# Altium project Filter_PCB_Project.PrjPcb
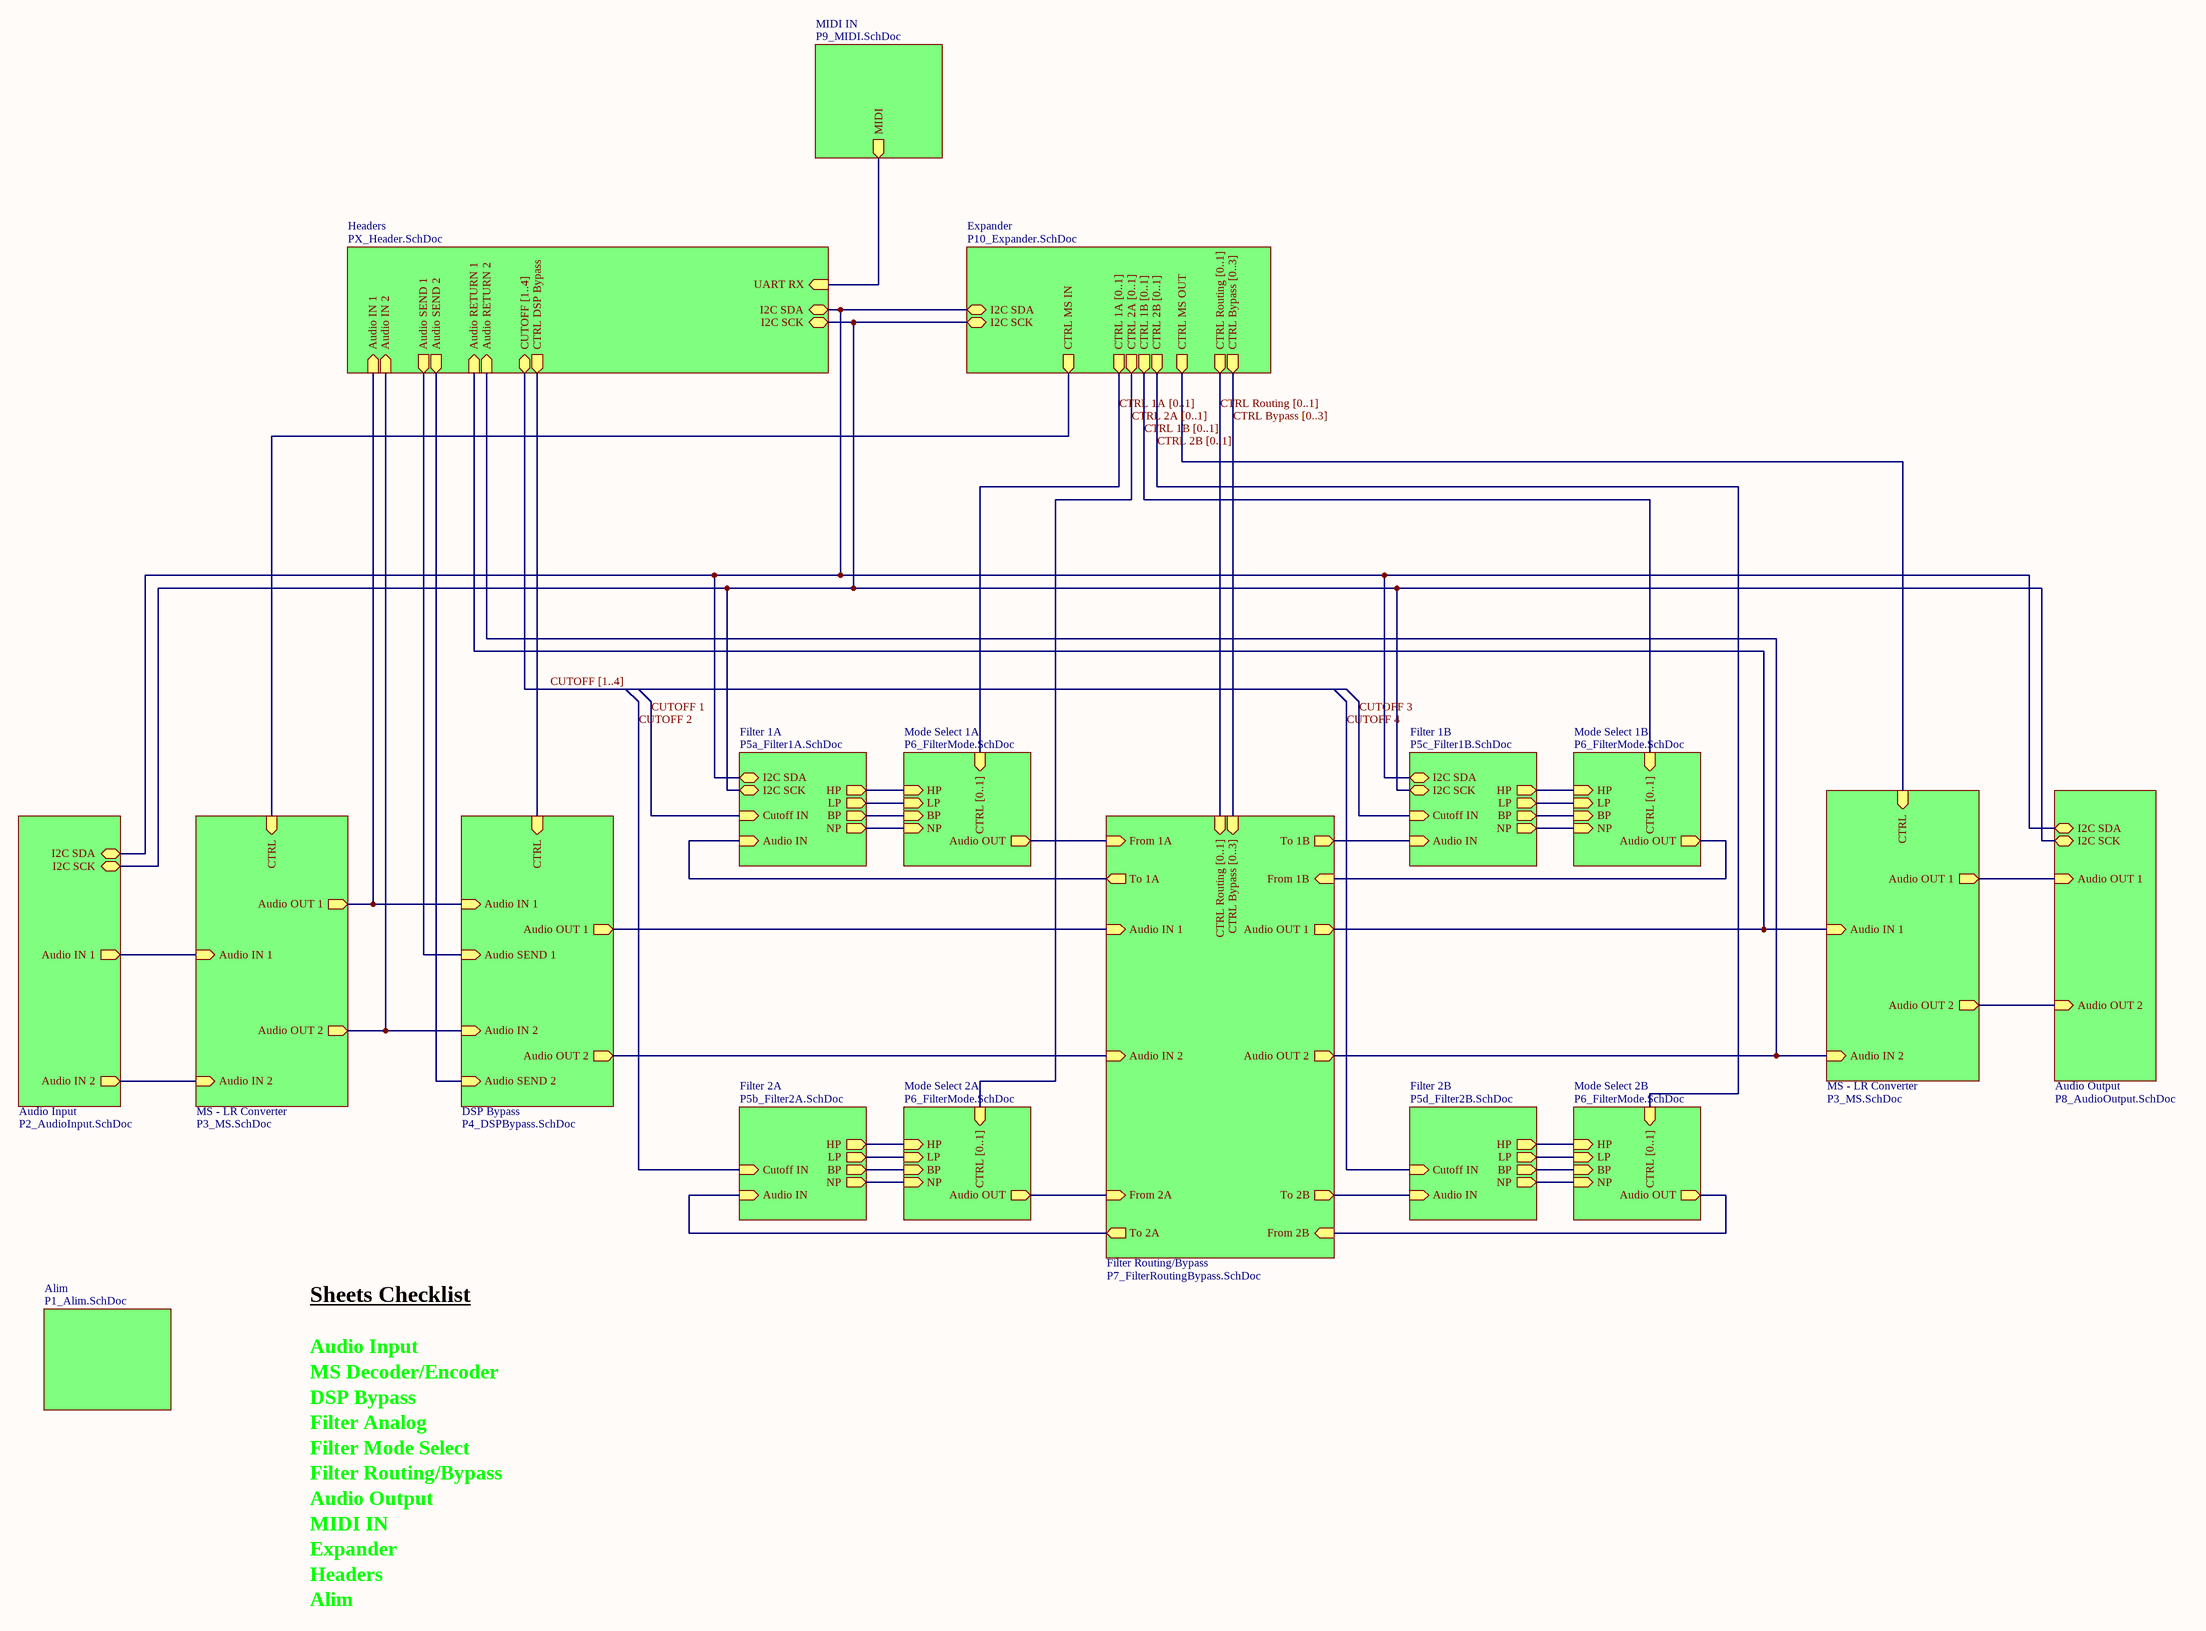
[diagram p0: P0_MASTER.SchDoc]
11 sheets, 315 parts. Net scope: hierarchical (ports join the sheet entries above them; power ports are global).
Sheets:
  P0_MASTER.SchDoc
    Audio Input = P2_AudioInput.SchDoc
    Alim = P1_Alim.SchDoc
    MS - LR Converter = P3_MS.SchDoc
    Mode Select 1A = P6_FilterMode.SchDoc
    Filter 2A = P5b_Filter2A.SchDoc
    Mode Select 2A = P6_FilterMode.SchDoc
    Filter Routing/Bypass = P7_FilterRoutingBypass.SchDoc
    Filter 1B = P5c_Filter1B.SchDoc
    Mode Select 1B = P6_FilterMode.SchDoc
    Mode Select 2B = P6_FilterMode.SchDoc
    MS - LR Converter = P3_MS.SchDoc
    Audio Output = P8_AudioOutput.SchDoc
    Expander = P10_Expander.SchDoc
    MIDI IN = P9_MIDI.SchDoc

## Sheet P0_MASTER.SchDoc
size C

### Sub-sheets
Alim = P1_Alim.SchDoc: no entries
Audio Input = P2_AudioInput.SchDoc: Audio IN 1 (out), I2C SCK, I2C SDA, Audio IN 2 (out)
Audio Output = P8_AudioOutput.SchDoc: Audio OUT 1 (in), I2C SCK, I2C SDA, Audio OUT 2 (in)
DSP Bypass = P4_DSPBypass.SchDoc (file not in this document): Audio SEND 1 (in), Audio SEND 2 (in), Audio IN 1 (in), Audio IN 2 (in), Audio OUT 1 (out), Audio OUT 2 (out), CTRL (in)
Expander = P10_Expander.SchDoc: I2C SCK, I2C SDA, CTRL MS IN (out), CTRL 1A [0..1] (out), CTRL 2A [0..1] (out), CTRL 1B [0..1] (out), CTRL 2B [0..1] (out), CTRL MS OUT (out), CTRL Routing [0..1] (out), CTRL Bypass [0..3] (out)
Filter 1A = P5a_Filter1A.SchDoc (file not in this document): HP (out), LP (out), BP (out), NP (out), Audio IN (in), I2C SCK, I2C SDA, Cutoff IN (in)
Filter 1B = P5c_Filter1B.SchDoc: HP (out), LP (out), BP (out), NP (out), Audio IN (in), I2C SCK, I2C SDA, Cutoff IN (in)
Filter 2A = P5b_Filter2A.SchDoc: HP (out), LP (out), BP (out), NP (out), Audio IN (in), Cutoff IN (in)
Filter 2B = P5d_Filter2B.SchDoc (file not in this document): HP (out), LP (out), BP (out), NP (out), Audio IN (in), Cutoff IN (in)
Filter Routing/Bypass = P7_FilterRoutingBypass.SchDoc: From 1A (in), From 2A (in), To 2A (out), To 1A (out), Audio IN 1 (in), Audio IN 2 (in), Audio OUT 1 (out), Audio OUT 2 (out), To 1B (out), From 1B (in), To 2B (out), From 2B (in), CTRL Routing [0..1] (in), CTRL Bypass [0..3] (in)
Headers = PX_Header.SchDoc (file not in this document): Audio IN 1 (in), Audio IN 2 (in), Audio SEND 1 (out), Audio SEND 2 (out), Audio RETURN 1 (in), Audio RETURN 2 (in), I2C SCK, I2C SDA, CUTOFF [1..4], UART RX (in), CTRL DSP Bypass (out)
MIDI IN = P9_MIDI.SchDoc: MIDI (out)
Mode Select 1A = P6_FilterMode.SchDoc: HP (in), LP (in), BP (in), NP (in), Audio OUT (out), CTRL [0..1] (in)
Mode Select 1B = P6_FilterMode.SchDoc: HP (in), LP (in), BP (in), NP (in), Audio OUT (out), CTRL [0..1] (in)
Mode Select 2A = P6_FilterMode.SchDoc: HP (in), LP (in), BP (in), NP (in), Audio OUT (out), CTRL [0..1] (in)
Mode Select 2B = P6_FilterMode.SchDoc: HP (in), LP (in), BP (in), NP (in), Audio OUT (out), CTRL [0..1] (in)
MS - LR Converter = P3_MS.SchDoc: Audio IN 1 (in), Audio IN 2 (in), Audio OUT 1 (out), Audio OUT 2 (out), CTRL (in)
MS - LR Converter = P3_MS.SchDoc: Audio IN 1 (in), Audio IN 2 (in), Audio OUT 1 (out), Audio OUT 2 (out), CTRL (in)

### Nets
CUTOFF 1: sheet Filter 1A/Cutoff IN
CUTOFF 4: sheet Filter 2B/Cutoff IN
From Audio IN 2: sheet DSP Bypass/Audio OUT 2, sheet Filter Routing/Bypass/Audio IN 2
To 1A: sheet DSP Bypass/Audio OUT 1, sheet Filter Routing/Bypass/Audio IN 1
NetC17_1: sheet Audio Input/Audio IN 1, sheet MS - LR Converter/Audio IN 1
NetC31_1: sheet Audio Input/Audio IN 2, sheet MS - LR Converter/Audio IN 2
NetC61_2: sheet Filter 2A/LP, sheet Mode Select 2A/LP
NetC62_2: sheet Filter 2A/BP, sheet Mode Select 2A/BP
NetC69_2: sheet Filter 1B/LP, sheet Mode Select 1B/LP
NetC70_2: sheet Filter 1B/BP, sheet Mode Select 1B/BP
NetC85_Mode_Select_1A_1: sheet Mode Select 1A/Audio OUT, sheet Filter Routing/Bypass/From 1A
NetC85_Mode_Select_1B_1: sheet Filter Routing/Bypass/From 1B, sheet Mode Select 1B/Audio OUT
NetC85_Mode_Select_2A_1: sheet Mode Select 2A/Audio OUT, sheet Filter Routing/Bypass/From 2A
NetC85_Mode_Select_2B_1: sheet Filter Routing/Bypass/From 2B, sheet Mode Select 2B/Audio OUT
NetC100_2: sheet MS - LR Converter/Audio OUT 1, sheet Audio Output/Audio OUT 1
NetC104_2: sheet MS - LR Converter/Audio OUT 2, sheet Audio Output/Audio OUT 2
NetR48_MS_-_LR_Converter#1_1: sheet MS - LR Converter/CTRL, sheet Expander/CTRL MS IN
NetR48_MS_-_LR_Converter#2_1: sheet MS - LR Converter/CTRL, sheet Expander/CTRL MS OUT
NetR81_2: sheet Filter 2A/NP, sheet Mode Select 2A/NP
NetR83_2: sheet Filter 2A/HP, sheet Mode Select 2A/HP
NetR92_2: sheet Filter 2A/Audio IN, sheet Filter Routing/Bypass/To 2A
NetR101_2: sheet Filter 1B/NP, sheet Mode Select 1B/NP
NetR103_2: sheet Filter 1B/HP, sheet Mode Select 1B/HP
NetR112_2: sheet Filter Routing/Bypass/To 1B, sheet Filter 1B/Audio IN
NetR172_1: sheet Headers/UART RX, sheet MIDI IN/MIDI
NetU2_2: sheet Audio Input/I2C SCK, sheet Headers/I2C SCK, sheet Filter 1A/I2C SCK, sheet Filter 1B/I2C SCK, sheet Audio Output/I2C SCK, sheet Expander/I2C SCK
NetU2_3: sheet Audio Input/I2C SDA, sheet Headers/I2C SDA, sheet Filter 1A/I2C SDA, sheet Filter 1B/I2C SDA, sheet Audio Output/I2C SDA, sheet Expander/I2C SDA
NetU4_MS_-_LR_Converter#1_9: sheet Headers/Audio IN 2, sheet DSP Bypass/Audio IN 2, sheet MS - LR Converter/Audio OUT 2
NetU4_MS_-_LR_Converter#1_12: sheet Headers/Audio IN 1, sheet DSP Bypass/Audio IN 1, sheet MS - LR Converter/Audio OUT 1
NetU4_MS_-_LR_Converter#2_4: sheet Headers/Audio RETURN 1, sheet Filter Routing/Bypass/Audio OUT 1, sheet MS - LR Converter/Audio IN 1
NetU4_MS_-_LR_Converter#2_7: sheet Headers/Audio RETURN 2, sheet Filter Routing/Bypass/Audio OUT 2, sheet MS - LR Converter/Audio IN 2
NetU20_Mode_Select_1A_11: sheet Filter 1A/NP, sheet Mode Select 1A/NP
NetU20_Mode_Select_1A_12: sheet Filter 1A/HP, sheet Mode Select 1A/HP
NetU20_Mode_Select_1A_14: sheet Filter 1A/LP, sheet Mode Select 1A/LP
NetU20_Mode_Select_1A_15: sheet Filter 1A/BP, sheet Mode Select 1A/BP
NetU20_Mode_Select_2B_11: sheet Filter 2B/NP, sheet Mode Select 2B/NP
NetU20_Mode_Select_2B_12: sheet Filter 2B/HP, sheet Mode Select 2B/HP
NetU20_Mode_Select_2B_14: sheet Filter 2B/LP, sheet Mode Select 2B/LP
NetU20_Mode_Select_2B_15: sheet Filter 2B/BP, sheet Mode Select 2B/BP
NetU21_3: sheet Filter 1A/Audio IN, sheet Filter Routing/Bypass/To 1A
NetU30_3: sheet Filter Routing/Bypass/To 2B, sheet Filter 2B/Audio IN
(unnamed): sheet Headers/Audio SEND 1, sheet DSP Bypass/Audio SEND 1
(unnamed): sheet Headers/Audio SEND 2, sheet DSP Bypass/Audio SEND 2
(unnamed): sheet Headers/CTRL DSP Bypass, sheet DSP Bypass/CTRL

### Buses and harness runs
bus CTRL 1A [0..1] = sheet Expander/CTRL 1A [0..1] = sheet Mode Select 1A/CTRL [0..1]
bus CTRL 1B [0..1] = sheet Expander/CTRL 1B [0..1] = sheet Mode Select 1B/CTRL [0..1]
bus CTRL 2A [0..1] = sheet Expander/CTRL 2A [0..1] = sheet Mode Select 2A/CTRL [0..1]
bus CTRL 2B [0..1] = sheet Expander/CTRL 2B [0..1] = sheet Mode Select 2B/CTRL [0..1]
bus CTRL Bypass [0..3] = sheet Expander/CTRL Bypass [0..3] = sheet Filter Routing/Bypass/CTRL Bypass [0..3]
bus CTRL Routing [0..1] = sheet Expander/CTRL Routing [0..1] = sheet Filter Routing/Bypass/CTRL Routing [0..1]
bus CUTOFF [1..4] = sheet Headers/CUTOFF [1..4]

### Notes on the sheet
- Sheets Checklist
- Audio Input
- MS Decoder/Encoder
- DSP Bypass
- Filter Analog
- Filter Mode Select
- Filter Routing/Bypass
- Audio Output
- MIDI IN
- Expander
- Headers
- Alim

## Sheet P2_AudioInput.SchDoc
size 254 x 241 mm
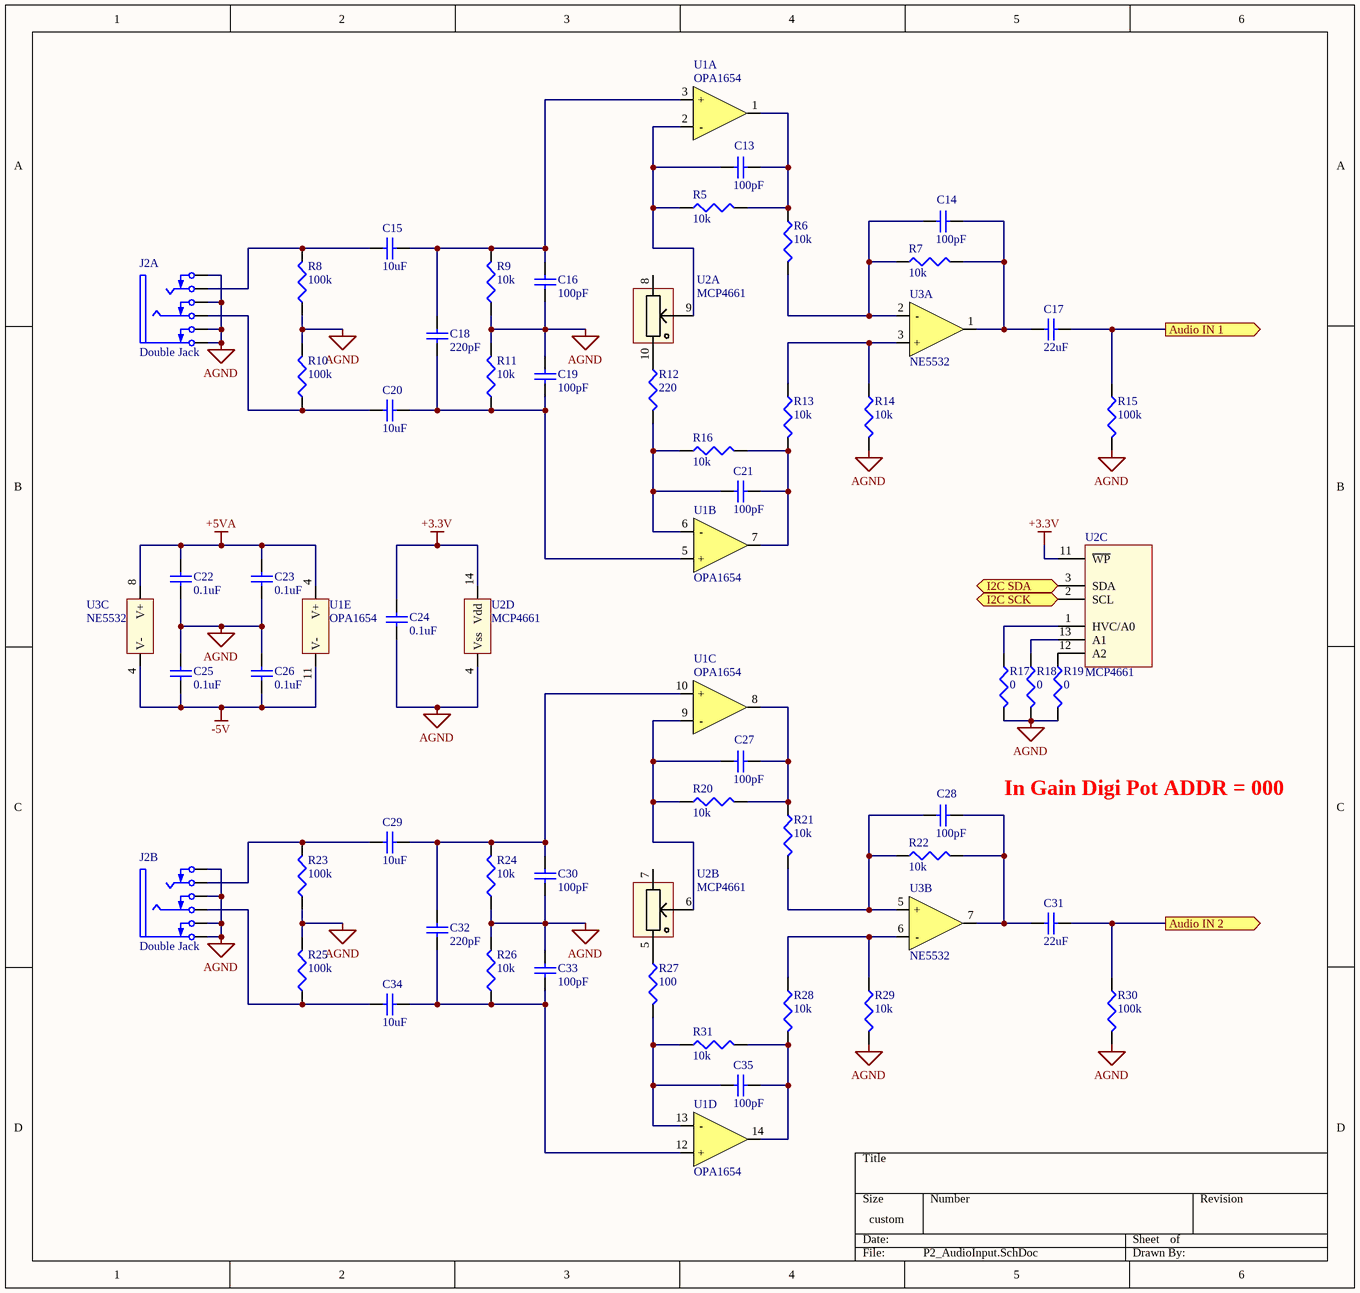
[diagram p1: P2_AudioInput.SchDoc]

### Parts
C13  100pF  [CAP 0603 (1608 metric)]
C14  100pF  [CAP 0603 (1608 metric)]
C15  10uF  [CAP 0603 (1608 metric)]
C16  100pF  [CAP 0603 (1608 metric)]
C17  22uF  [CAP 0603 (1608 metric)]
C18  220pF  [CAP 0603 (1608 metric)]
C19  100pF  [CAP 0603 (1608 metric)]
C20  10uF  [CAP 0603 (1608 metric)]
C21  100pF  [CAP 0603 (1608 metric)]
C22  0.1uF  [CAP 0603 (1608 metric)]
C23  0.1uF  [CAP 0603 (1608 metric)]
C24  0.1uF  [CAP 0603 (1608 metric)]
C25  0.1uF  [CAP 0603 (1608 metric)]
C26  0.1uF  [CAP 0603 (1608 metric)]
C27  100pF  [CAP 0603 (1608 metric)]
C28  100pF  [CAP 0603 (1608 metric)]
C29  10uF  [CAP 0603 (1608 metric)]
C30  100pF  [CAP 0603 (1608 metric)]
C31  22uF  [CAP 0603 (1608 metric)]
C32  220pF  [CAP 0603 (1608 metric)]
C33  100pF  [CAP 0603 (1608 metric)]
C34  10uF  [CAP 0603 (1608 metric)]
C35  100pF  [CAP 0603 (1608 metric)]
J2  Double Jack  (parts A,B of 2)
R5  10k  [RES 0603 (1608 metric)]
R6  10k  [RES 0603 (1608 metric)]
R7  10k  [RES 0603 (1608 metric)]
R8  100k  [RES 0603 (1608 metric)]
R9  10k  [RES 0603 (1608 metric)]
R10  100k  [RES 0603 (1608 metric)]
R11  10k  [RES 0603 (1608 metric)]
R12  220  [RES 0603 (1608 metric)]
R13  10k  [RES 0603 (1608 metric)]
R14  10k  [RES 0603 (1608 metric)]
R15  100k  [RES 0603 (1608 metric)]
R16  10k  [RES 0603 (1608 metric)]
R17  0  [RES 0603 (1608 metric)]
R18  0  [RES 0603 (1608 metric)]
R19  0  [RES 0603 (1608 metric)]
R20  10k  [RES 0603 (1608 metric)]
R21  10k  [RES 0603 (1608 metric)]
R22  10k  [RES 0603 (1608 metric)]
R23  100k  [RES 0603 (1608 metric)]
R24  10k  [RES 0603 (1608 metric)]
R25  100k  [RES 0603 (1608 metric)]
R26  10k  [RES 0603 (1608 metric)]
R27  100  [RES 0603 (1608 metric)]
R28  10k  [RES 0603 (1608 metric)]
R29  10k  [RES 0603 (1608 metric)]
R30  100k  [RES 0603 (1608 metric)]
R31  10k  [RES 0603 (1608 metric)]
U1  OPA1654  (parts A,B,C,D,E of 5)
U2  MCP4661  (parts A,B,C,D of 4)
U3  NE5532  (parts A,B,C of 3)

### Ports
Audio IN 1 (out), Audio IN 2 (out), I2C SCK, I2C SDA

### Nets
+3.3V: C24.1 U2.11(~{WP}) U2.14(Vdd)
+5VA: C22.1 C23.1 U1.4(V+) U3.8(V+)
-5V: C25.2 C26.2 U1.11(V-) U3.4(V-)
AGND: C16.2 C19.1 C22.2 C23.2 C24.2 C25.1 C26.1 C30.2 C33.1 J2.1(SB) J2.2(RB) J2.3(TB) J2.4(S) J2.7(SB) J2.8(RB) J2.9(TB) J2.10(S) R8.1 R9.1 R10.2 R11.2 R14.2 R15.2 R17.2 R18.2 R19.2 R23.1 R24.1 R25.2 R26.2 R29.2 R30.2 U2.4(Vss)
NetC13_1: C13.1 R5.1 U1.2(-) U2.9(P0W)
NetC13_2: C13.2 R5.2 R6.1 U1.1(OUT)
NetC14_1: C14.1 R6.2 R7.1 U3.2(-)
NetC14_2: C14.2 C17.2 R7.2 U3.1(OUT)
NetC15_1: C15.1 C16.1 C18.1 R9.2 U1.3(+)
NetC15_2: C15.2 J2.12(T) R8.2
NetC17_1: C17.1 R15.1 ; port Audio IN 1
NetC18_2: C18.2 C19.2 C20.1 R11.1 U1.5(+)
NetC20_2: C20.2 J2.11(R) R10.1
NetC21_1: C21.1 R12.2 R16.1 U1.6(-)
NetC21_2: C21.2 R13.2 R16.2 U1.7(OUT)
NetC27_1: C27.1 R20.1 U1.9(-) U2.6(P1W)
NetC27_2: C27.2 R20.2 R21.1 U1.8(OUT)
NetC28_1: C28.1 R21.2 R22.1 U3.5(+)
NetC28_2: C28.2 C31.2 R22.2 U3.7(OUT)
NetC29_1: C29.1 C30.1 C32.1 R24.2 U1.10(+)
NetC29_2: C29.2 J2.6(T) R23.2
NetC31_1: C31.1 R30.1 ; port Audio IN 2
NetC32_2: C32.2 C33.2 C34.1 R26.1 U1.12(+)
NetC34_2: C34.2 J2.5(R) R25.1
NetC35_1: C35.1 R27.2 R31.1 U1.13(-)
NetC35_2: C35.2 R28.2 R31.2 U1.14(OUT)
NetR12_1: R12.1 U2.10(P0B)
NetR13_1: R13.1 R14.1 U3.3(+)
NetR17_1: R17.1 U2.1(HVC/A0)
NetR18_1: R18.1 U2.13(A1)
NetR19_1: R19.1 U2.12(A2)
NetR27_1: R27.1 U2.5(P1B)
NetR28_1: R28.1 R29.1 U3.6(-)
NetU2_2: U2.2(SCL) ; port I2C SCK
NetU2_3: U2.3(SDA) ; port I2C SDA

Not connected (* = marked no-connect by the designer): U2 7(P1A) 8(P0A)

### Notes on the sheet
- In Gain Digi Pot ADDR = 000

### Library data of the parts
C13-C35 = Cap Semi: Capacitor (Semiconductor SIM Model)
  C13 C14 C16 C19 C21 C27 C28 C30 C33 C35: Value: 100pF
  C15 C20 C29 C34: Value: 10uF
  C17 C31: Value: 22uF
  C18 C32: Value: 220pF
  C22-C26: Value: 0.1uF
J2 = Dual TRS Jack Bypassed: Dual Jack stereo bypassed
R5-R31 = Res3: Resistor
  R5-R7 R9 R11 R13 R14 R16 R20-R22 R24 R26 R28 R29 R31: Value: 10k
  R8 R10 R15 R23 R25 R30: Value: 100k
  R12: Value: 220
  R17-R19: Value: 0
  R27: Value: 100
U1 = OPA1654: Quad Audio OpAmp
U2 = MCP4661: Dual DigiPot non volatile I2C
U3 = NE5532: Dual Audio OpAmp

## Sheet P1_Alim.SchDoc
size 254 x 228 mm
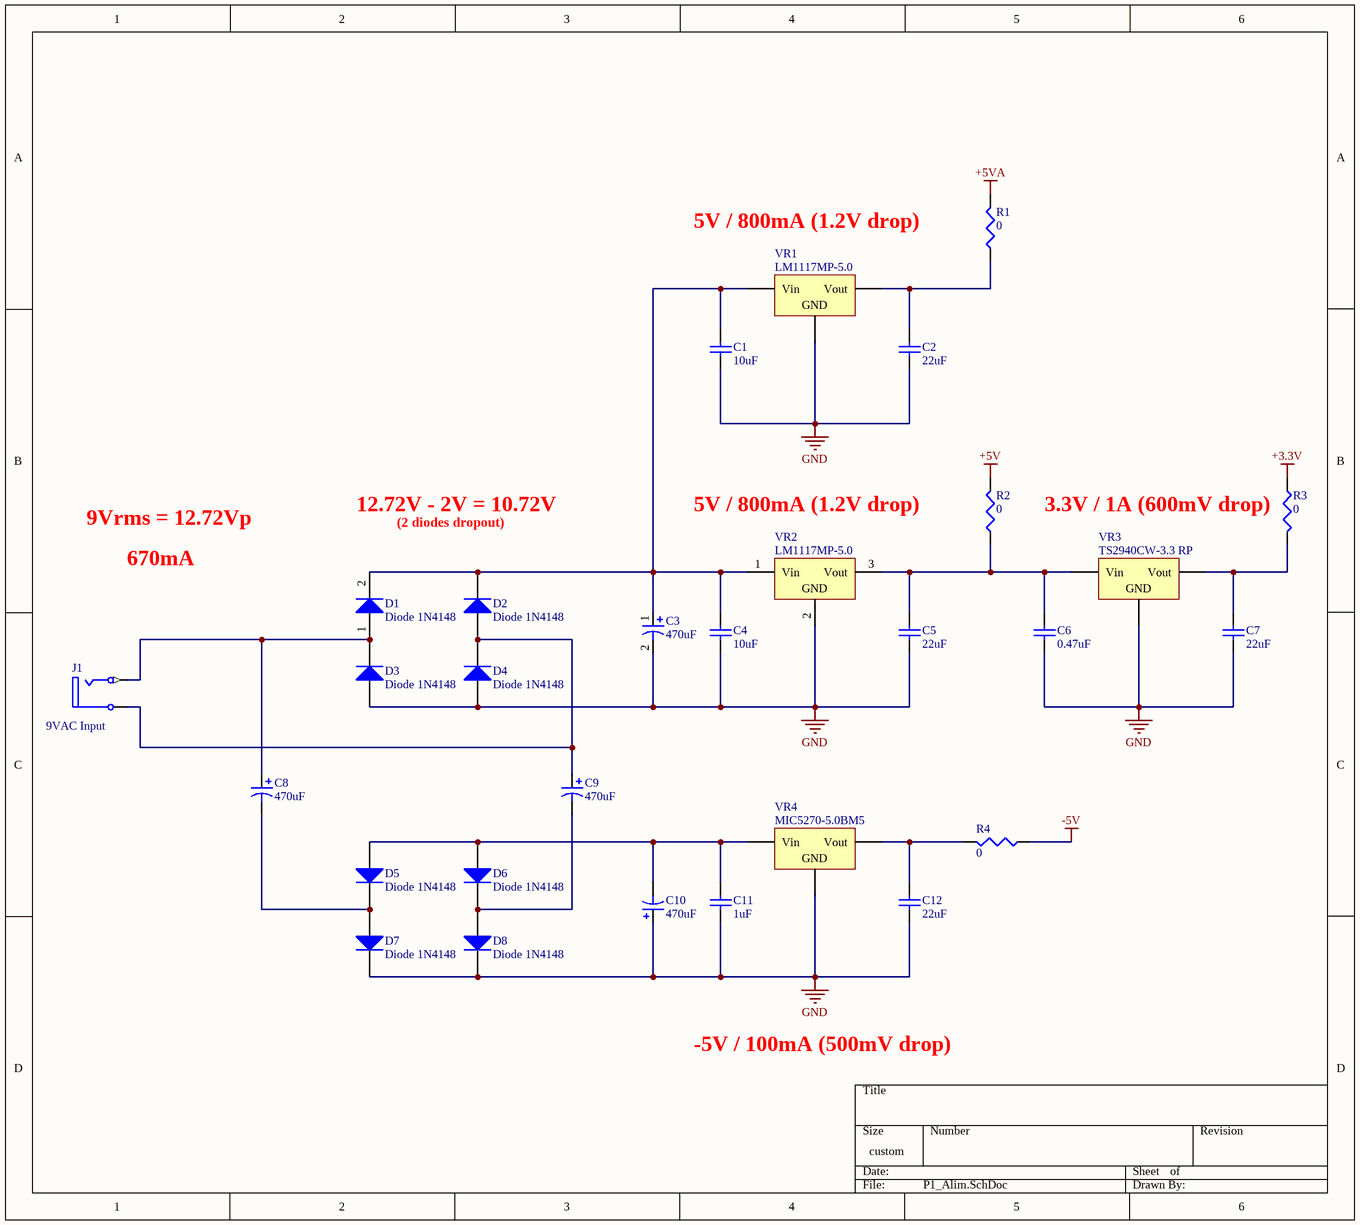
[diagram p2: P1_Alim.SchDoc]

### Parts
C1  10uF  [CAP 0603 (1608 metric)]
C2  22uF  [CAP 0603 (1608 metric)]
C3  470uF  [Condo Electro 5mm]
C4  10uF  [CAP 0603 (1608 metric)]
C5  22uF  [CAP 0603 (1608 metric)]
C6  0.47uF  [CAP 0603 (1608 metric)]
C7  22uF  [CAP 0603 (1608 metric)]
C8  470uF  [Condo Electro 5mm]
C9  470uF  [Condo Electro 5mm]
C10  470uF  [Condo Electro 5mm]
C11  1uF  [CAP 0603 (1608 metric)]
C12  22uF  [CAP 0603 (1608 metric)]
D1  Diode 1N4148  [1N4148]
D2  Diode 1N4148  [1N4148]
D3  Diode 1N4148  [1N4148]
D4  Diode 1N4148  [1N4148]
D5  Diode 1N4148  [1N4148]
D6  Diode 1N4148  [1N4148]
D7  Diode 1N4148  [1N4148]
D8  Diode 1N4148  [1N4148]
J1  9VAC Input
R1  0  [RES 0603 (1608 metric)]
R2  0  [RES 0603 (1608 metric)]
R3  0  [RES 0603 (1608 metric)]
R4  0  [RES 0603 (1608 metric)]
VR1  LM1117MP-5.0  [SOT-223]
VR2  LM1117MP-5.0  [SOT-223]
VR3  TS2940CW-3.3 RP  [SOT-223]
VR4  MIC5270-5.0BM5

### Nets
+3.3V: R3.1
+5V: R2.2
+5VA: R1.2
-5V: R4.1
GND: C1.1 C2.1 C3.2 C4.1 C5.1 C6.1 C7.1 C10.1 C11.1 C12.1 D3.1(A) D4.1(A) D7.2(K) D8.2(K) VR1.2(GND) VR2.2(GND) VR3.2(GND) VR4.2(GND)
NetC1_2: C1.2 C3.1 C4.2 D1.2(K) D2.2(K) VR1.1(Vin) VR2.1(Vin)
NetC2_2: C2.2 R1.1 VR1.3(Vout)
NetC5_2: C5.2 C6.2 R2.1 VR2.3(Vout) VR3.1(Vin)
NetC7_2: C7.2 R3.2 VR3.3(Vout)
NetC8_1: C8.1 D1.1(A) D3.2(K) J1.1(T)
NetC8_2: C8.2 D5.2(K) D7.1(A)
NetC9_1: C9.1 D2.1(A) D4.2(K) J1.5(S)
NetC9_2: C9.2 D6.2(K) D8.1(A)
NetC10_2: C10.2 C11.2 D5.1(A) D6.1(A) VR4.1(Vin)
NetC12_2: C12.2 R4.2 VR4.3(Vout)

### Notes on the sheet
- 5V / 800mA (1.2V drop)
- 9Vrms = 12.72Vp
- 670mA
- 12.72V - 2V = 10.72V
- (2 diodes dropout)
- (near R3) 3.3V / 1A (600mV drop)
- -5V / 100mA (500mV drop)

### Library data of the parts
C1 C2 C4-C7 C11 C12 = Cap Semi: Capacitor (Semiconductor SIM Model)
  C1 C4: Value: 10uF
  C2 C5 C7 C12: Value: 22uF
  C6: Value: 0.47uF
  C11: Value: 1uF
C3 C8-C10 = Cap Pol1: Polarized Capacitor (Radial); Value: 470uF
D1-D8 = Diode 1N4148: High Conductance Fast Diode
J1 = Phonejack2: Jack Socket, 1/4" [6.5mm], Thru-Hole, Vertical, 2-Conductor Open Circuit
R1-R4 = Res3: Resistor; Value: 0
VR1-VR4 = Volt Reg: Voltage Regulator

## Sheet P3_MS.SchDoc
size 279 x 177 mm
Used 2 times, as channels MS - LR Converter, MS - LR Converter. Parts and nets are listed once, with the designators drawn on the sheet.
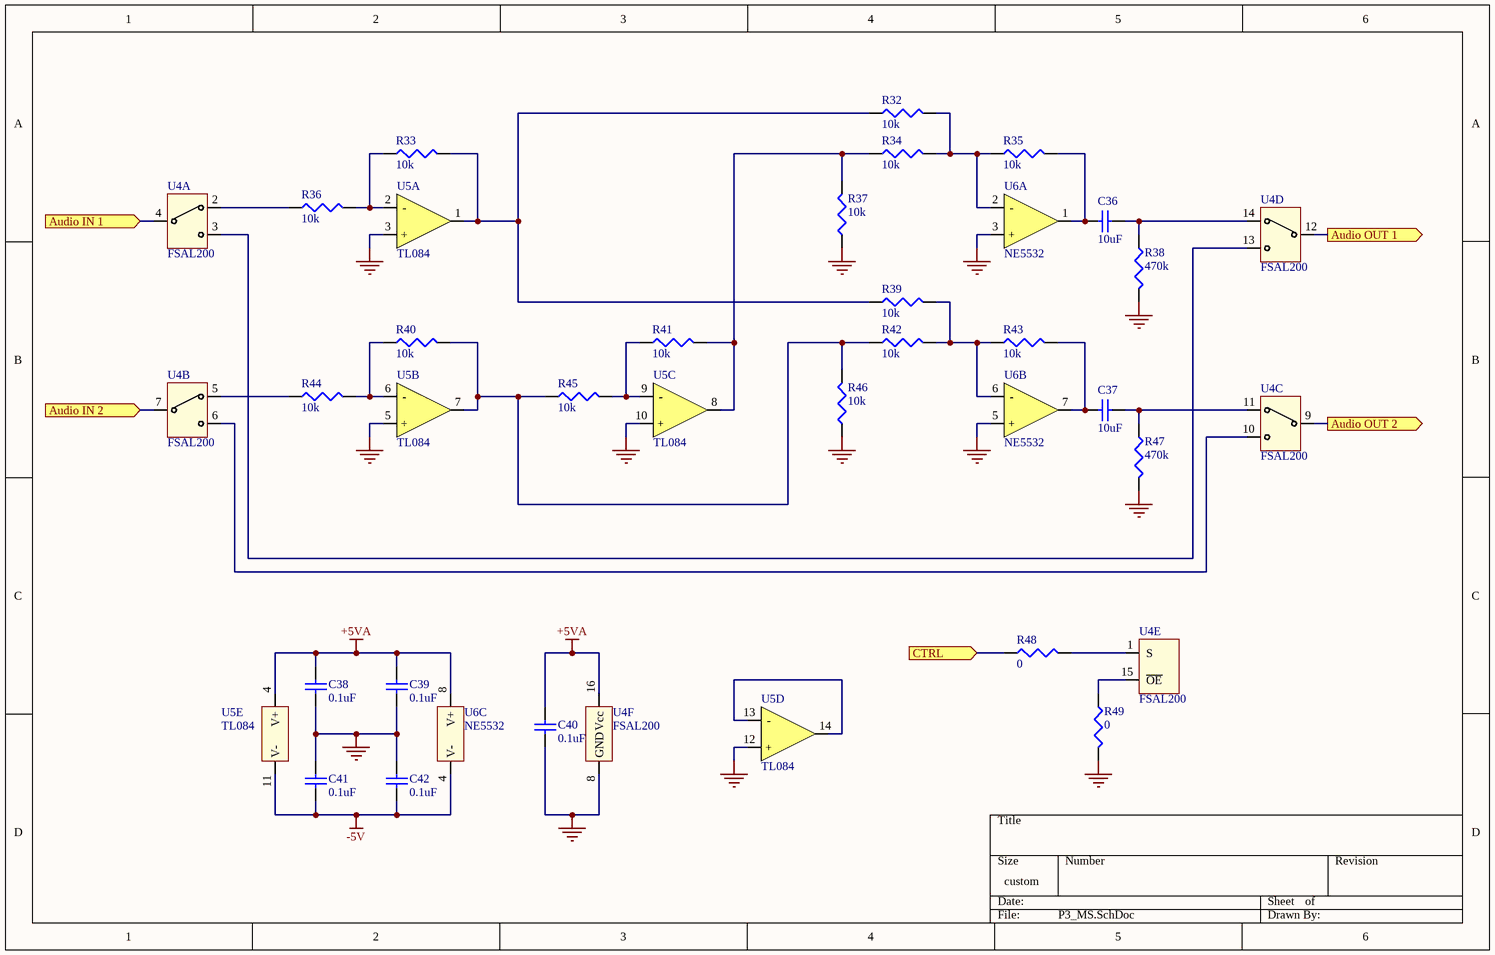
[diagram p3: P3_MS.SchDoc]

### Parts
C36  10uF  [CAP 0603 (1608 metric)]
C37  10uF  [CAP 0603 (1608 metric)]
C38  0.1uF  [CAP 0603 (1608 metric)]
C39  0.1uF  [CAP 0603 (1608 metric)]
C40  0.1uF  [CAP 0603 (1608 metric)]
C41  0.1uF  [CAP 0603 (1608 metric)]
C42  0.1uF  [CAP 0603 (1608 metric)]
R32  10k  [RES 0603 (1608 metric)]
R33  10k  [RES 0603 (1608 metric)]
R34  10k  [RES 0603 (1608 metric)]
R35  10k  [RES 0603 (1608 metric)]
R36  10k  [RES 0603 (1608 metric)]
R37  10k  [RES 0603 (1608 metric)]
R38  470k  [RES 0603 (1608 metric)]
R39  10k  [RES 0603 (1608 metric)]
R40  10k  [RES 0603 (1608 metric)]
R41  10k  [RES 0603 (1608 metric)]
R42  10k  [RES 0603 (1608 metric)]
R43  10k  [RES 0603 (1608 metric)]
R44  10k  [RES 0603 (1608 metric)]
R45  10k  [RES 0603 (1608 metric)]
R46  10k  [RES 0603 (1608 metric)]
R47  470k  [RES 0603 (1608 metric)]
R48  0  [RES 0603 (1608 metric)]
R49  0  [RES 0603 (1608 metric)]
U4  FSAL200  (parts A,B,C,D,E,F of 6)
U5  TL084  (parts A,B,C,D,E of 5)
U6  NE5532  (parts A,B,C of 3)

### Ports
Audio IN 1 (in), Audio IN 2 (in), Audio OUT 1 (out), Audio OUT 2 (out), CTRL (in)

### Nets
+5VA: C38.1 C39.1 C40.1 U4.16(Vcc) U5.4(V+) U6.8(V+)
-5V: C41.2 C42.2 U5.11(V-) U6.4(V-)
GND: C38.2 C39.2 C40.2 C41.1 C42.1 R37.1 R38.2 R46.1 R47.2 R49.2 U4.8(GND) U5.3(+) U5.5(+) U5.10(+) U5.12(+) U6.3(+) U6.5(+)
Audio IN 1: U4.4(A) ; port Audio IN 1
Audio IN 2: U4.7(A) ; port Audio IN 2
Audio OUT 1: U4.12(A) ; port Audio OUT 1
Audio OUT 2: U4.9(A) ; port Audio OUT 2
CTRL: R48.1 ; port CTRL
NetC36_1: C36.1 R38.1 U4.14(B1)
NetC36_2: C36.2 R35.2 U6.1(OUT)
NetC37_1: C37.1 R47.1 U4.11(B1)
NetC37_2: C37.2 R43.2 U6.7(OUT)
NetR32_1: R32.1 R33.2 R39.1 U5.1(OUT)
NetR32_2: R32.2 R34.2 R35.1 U6.2(-)
NetR33_1: R33.1 R36.2 U5.2(-)
NetR34_1: R34.1 R37.2 R41.2 U5.8(OUT)
NetR36_1: R36.1 U4.2(B1)
NetR39_2: R39.2 R42.2 R43.1 U6.6(-)
NetR40_1: R40.1 R44.2 U5.6(-)
NetR40_2: R40.2 R42.1 R45.1 R46.2 U5.7(OUT)
NetR41_1: R41.1 R45.2 U5.9(-)
NetR44_1: R44.1 U4.5(B1)
NetR48_2: R48.2 U4.1(S)
NetR49_1: R49.1 U4.15(~{OE})
NetU4_3: U4.3(B2) U4.13(B2)
NetU4_6: U4.6(B2) U4.10(B2)
NetU5_13: U5.13(-) U5.14(OUT)

### Channels
MS - LR Converter: designators end in _MS_-_LR_Converter#1; ports Audio IN 1=NetC17_1 Audio IN 2=NetC31_1 Audio OUT 1=NetU4_MS_-_LR_Converter#1_12 Audio OUT 2=NetU4_MS_-_LR_Converter#1_9 CTRL=NetR48_MS_-_LR_Converter#1_1
MS - LR Converter: designators end in _MS_-_LR_Converter#2; ports Audio IN 1=NetU4_MS_-_LR_Converter#2_4 Audio IN 2=NetU4_MS_-_LR_Converter#2_7 Audio OUT 1=NetC100_2 Audio OUT 2=NetC104_2 CTRL=NetR48_MS_-_LR_Converter#2_1

### Library data of the parts
C36-C42 = Cap Semi: Capacitor (Semiconductor SIM Model)
  C36 C37: Value: 10uF
  C38-C42: Value: 0.1uF
R32-R49 = Res3: Resistor
  R32-R37 R39-R46: Value: 10k
  R38 R47: Value: 470k
  R48 R49: Value: 0
U4 = FSAL200: Quad 2:1 Multiplexer
U5 = TL084: Quad Audio OpAmp
U6 = NE5532: Dual Audio OpAmp

## Sheet P6_FilterMode.SchDoc
size 127 x 127 mm
Used 4 times, as channels Mode Select 1A, Mode Select 2A, Mode Select 1B, Mode Select 2B. Parts and nets are listed once, with the designators drawn on the sheet.
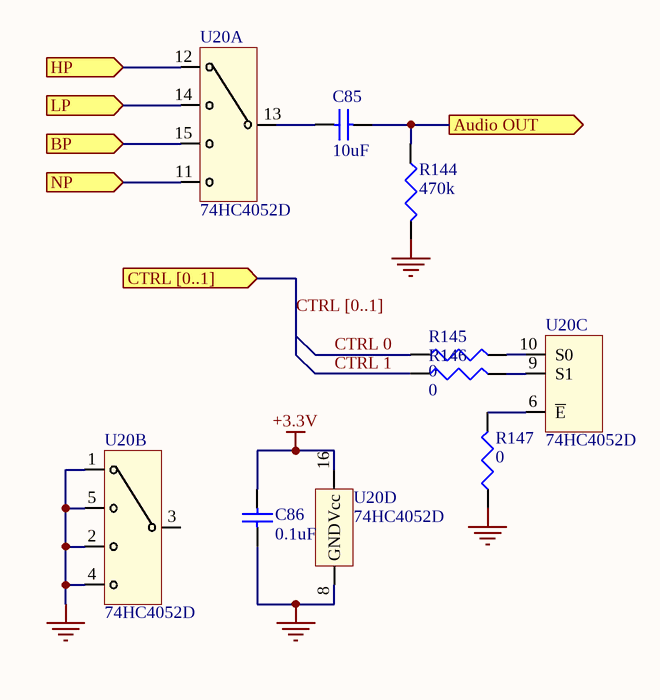
[diagram p4: P6_FilterMode.SchDoc]

### Parts
C85  10uF  [CAP 0603 (1608 metric)]
C86  0.1uF  [CAP 0603 (1608 metric)]
R144  470k  [RES 0603 (1608 metric)]
R145  0  [RES 0603 (1608 metric)]
R146  0  [RES 0603 (1608 metric)]
R147  0  [RES 0603 (1608 metric)]
U20  74HC4052D  (parts A,B,C,D of 4)

### Ports
Audio OUT (out), BP (in), CTRL [0..1] (in), HP (in), LP (in), NP (in)

### Nets
+3.3V: C86.1 U20.16(Vcc)
GND: C86.2 R144.2 R147.1 U20.1(2Y0) U20.2(2Y2) U20.4(2Y3) U20.5(2Y1) U20.8(GND)
Audio OUT: C85.1 R144.1 ; port Audio OUT
BP: U20.15(1Y2) ; port BP
CTRL 0: R145.1
CTRL 1: R146.1
HP: U20.12(1Y0) ; port HP
LP: U20.14(1Y1) ; port LP
NP: U20.11(1Y3) ; port NP
NetC85_2: C85.2 U20.13(1Z)
NetR145_2: R145.2 U20.10(S0)
NetR146_2: R146.2 U20.9(S1)
NetR147_2: R147.2 U20.6(~{E})

Not connected (* = marked no-connect by the designer): U20 3(2Z)

### Channels
Mode Select 1A: designators end in _Mode_Select_1A; ports Audio OUT=NetC85_Mode_Select_1A_1 BP=NetU20_Mode_Select_1A_15 HP=NetU20_Mode_Select_1A_12 LP=NetU20_Mode_Select_1A_14 NP=NetU20_Mode_Select_1A_11
Mode Select 2A: designators end in _Mode_Select_2A; ports Audio OUT=NetC85_Mode_Select_2A_1 BP=NetC62_2 HP=NetR83_2 LP=NetC61_2 NP=NetR81_2
Mode Select 1B: designators end in _Mode_Select_1B; ports Audio OUT=NetC85_Mode_Select_1B_1 BP=NetC70_2 HP=NetR103_2 LP=NetC69_2 NP=NetR101_2
Mode Select 2B: designators end in _Mode_Select_2B; ports Audio OUT=NetC85_Mode_Select_2B_1 BP=NetU20_Mode_Select_2B_15 HP=NetU20_Mode_Select_2B_12 LP=NetU20_Mode_Select_2B_14 NP=NetU20_Mode_Select_2B_11

### Buses and harness runs
bus CTRL [0..1] = port CTRL [0..1]

### Library data of the parts
C85 C86 = Cap Semi: Capacitor (Semiconductor SIM Model)
  C85: Value: 10uF
  C86: Value: 0.1uF
R144-R147 = Res3: Resistor
  R144: Value: 470k
  R145-R147: Value: 0
U20 = 74HC4052D: Dual 4:1 Multiplexer

## Sheet P5b_Filter2A.SchDoc
size A
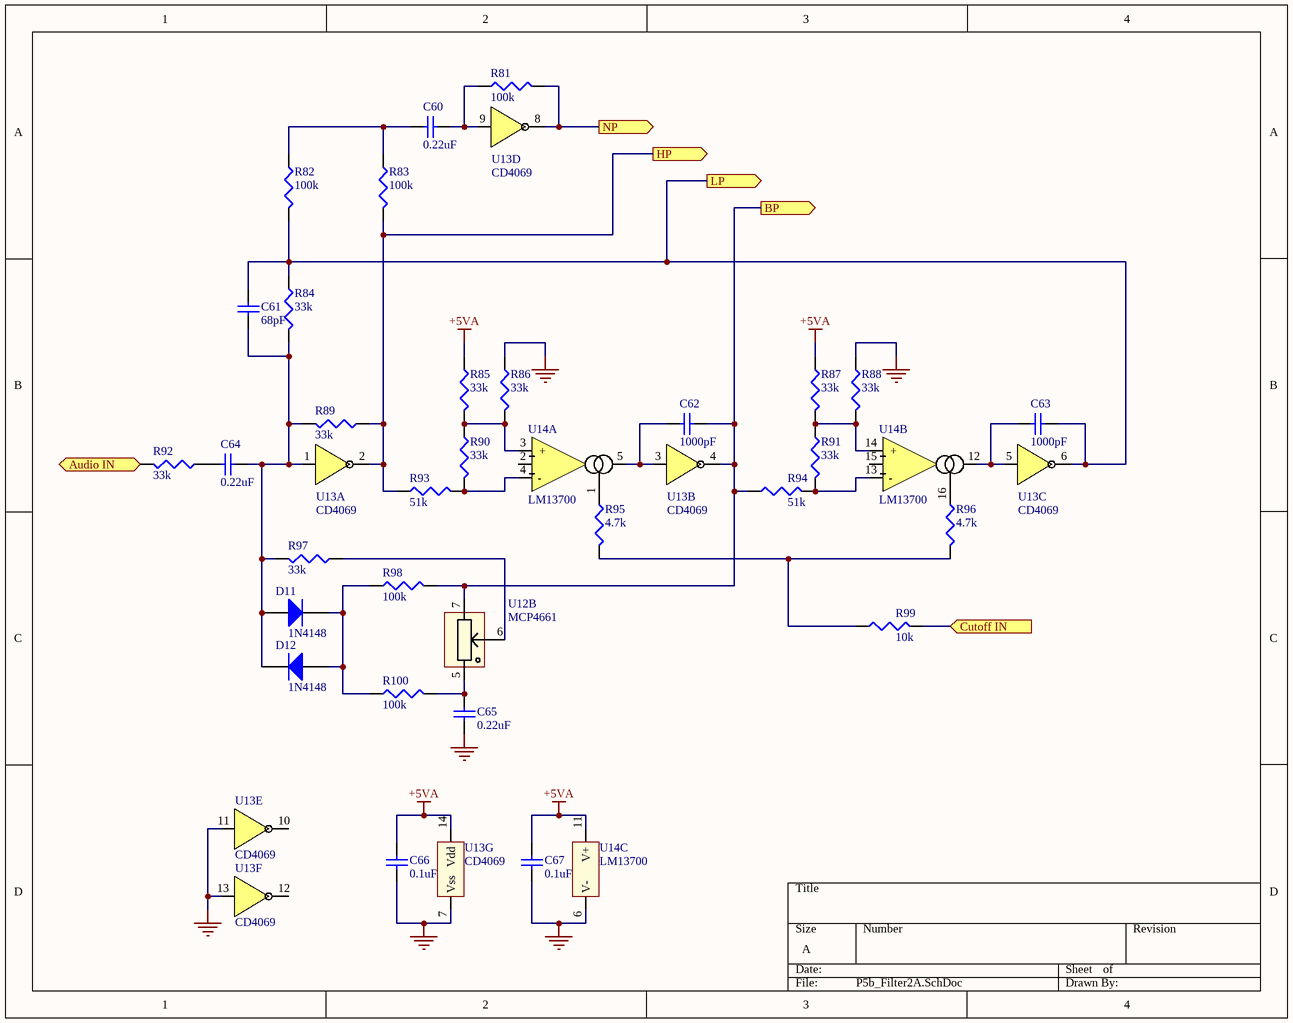
[diagram p5: P5b_Filter2A.SchDoc]

### Parts
C60  0.22uF  [CAP 0603 (1608 metric)]
C61  68pF  [CAP 0603 (1608 metric)]
C62  1000pF  [CAP 0603 (1608 metric)]
C63  1000pF  [CAP 0603 (1608 metric)]
C64  0.22uF  [CAP 0603 (1608 metric)]
C65  0.22uF  [CAP 0603 (1608 metric)]
C66  0.1uF  [CAP 0603 (1608 metric)]
C67  0.1uF  [CAP 0603 (1608 metric)]
D11  1N4148
D12  1N4148
R81  100k  [RES 0603 (1608 metric)]
R82  100k  [RES 0603 (1608 metric)]
R83  100k  [RES 0603 (1608 metric)]
R84  33k  [RES 0603 (1608 metric)]
R85  33k  [RES 0603 (1608 metric)]
R86  33k  [RES 0603 (1608 metric)]
R87  33k  [RES 0603 (1608 metric)]
R88  33k  [RES 0603 (1608 metric)]
R89  33k  [RES 0603 (1608 metric)]
R90  33k  [RES 0603 (1608 metric)]
R91  33k  [RES 0603 (1608 metric)]
R92  33k  [RES 0603 (1608 metric)]
R93  51k  [RES 0603 (1608 metric)]
R94  51k  [RES 0603 (1608 metric)]
R95  4.7k  [RES 0603 (1608 metric)]
R96  4.7k  [RES 0603 (1608 metric)]
R97  33k  [RES 0603 (1608 metric)]
R98  100k  [RES 0603 (1608 metric)]
R99  10k  [RES 0603 (1608 metric)]
R100  100k  [RES 0603 (1608 metric)]
U12  MCP4661  (part B of 4)
U13  CD4069  (parts A,B,C,D,E,F,G of 7)
U14  LM13700  (parts A,B,C of 3)

### Ports
Audio IN (in), BP (out), Cutoff IN (in), HP (out), LP (out), NP (out)

### Nets
+5VA: C66.1 C67.1 R85.1 R87.1 U13.14(Vdd) U14.11(V+)
GND: C65.2 C66.2 C67.2 R86.1 R88.1 U13.7(Vss) U13.11(E) U13.13(F) U14.6(V-)
CUTOFF 2: R99.2 ; port Cutoff IN
NetC60_1: C60.1 R82.1 R83.1
NetC60_2: C60.2 R81.1 U13.9(D)
NetC61_1: C61.1 C64.2 D11.1(A) D12.2(K) R84.2 R89.2 R97.2 U13.1(A)
NetC61_2: C61.2 C63.2 R82.2 R84.1 U13.6(~{C}) ; port LP
NetC62_1: C62.1 U13.3(B) U14.5(OUT)
NetC62_2: C62.2 R94.1 R98.2 U12.7(P1A) U13.4(~{B}) ; port BP
NetC63_1: C63.1 U13.5(C) U14.12(OUT)
NetC64_1: C64.1 R92.1
NetC65_1: C65.1 R100.2 U12.5(P1B)
NetD11_2: D11.2(K) D12.1(A) R98.1 R100.1
NetR81_2: R81.2 U13.8(~{D}) ; port NP
NetR83_2: R83.2 R89.1 R93.1 U13.2(~{A}) ; port HP
NetR85_2: R85.2 R86.2 R90.1 U14.3(+)
NetR87_2: R87.2 R88.2 R91.1 U14.14(+)
NetR90_2: R90.2 R93.2 U14.4(-)
NetR91_2: R91.2 R94.2 U14.13(-)
NetR92_2: R92.2 ; port Audio IN
NetR95_1: R95.1 U14.1(BIAS)
NetR95_2: R95.2 R96.2 R99.1
NetR96_1: R96.1 U14.16(BIAS)
NetR97_1: R97.1 U12.6(P1W)

Not connected (* = marked no-connect by the designer): U13 10(~{E}) 12(~{F}); U14 2(Diode_BIAS) 15(Diode_BIAS)

### Library data of the parts
C60-C67 = Cap Semi: Capacitor (Semiconductor SIM Model)
  C60 C64 C65: Value: 0.22uF
  C61: Value: 68pF
  C62 C63: Value: 1000pF
  C66 C67: Value: 0.1uF
D11 D12 = Diode 1N4148: High Conductance Fast Diode
R81-R100 = Res3: Resistor
  R81-R83 R98 R100: Value: 100k
  R84-R92 R97: Value: 33k
  R93 R94: Value: 51k
  R95 R96: Value: 4.7k
  R99: Value: 10k
U12 = MCP4661: Dual DigiPot non volatile I2C
U13 = CD4069: Hex Inverter
U14 = LM13700M: Dual Transconductance OpAmp

## Sheet P7_FilterRoutingBypass.SchDoc
size 304 x 241 mm
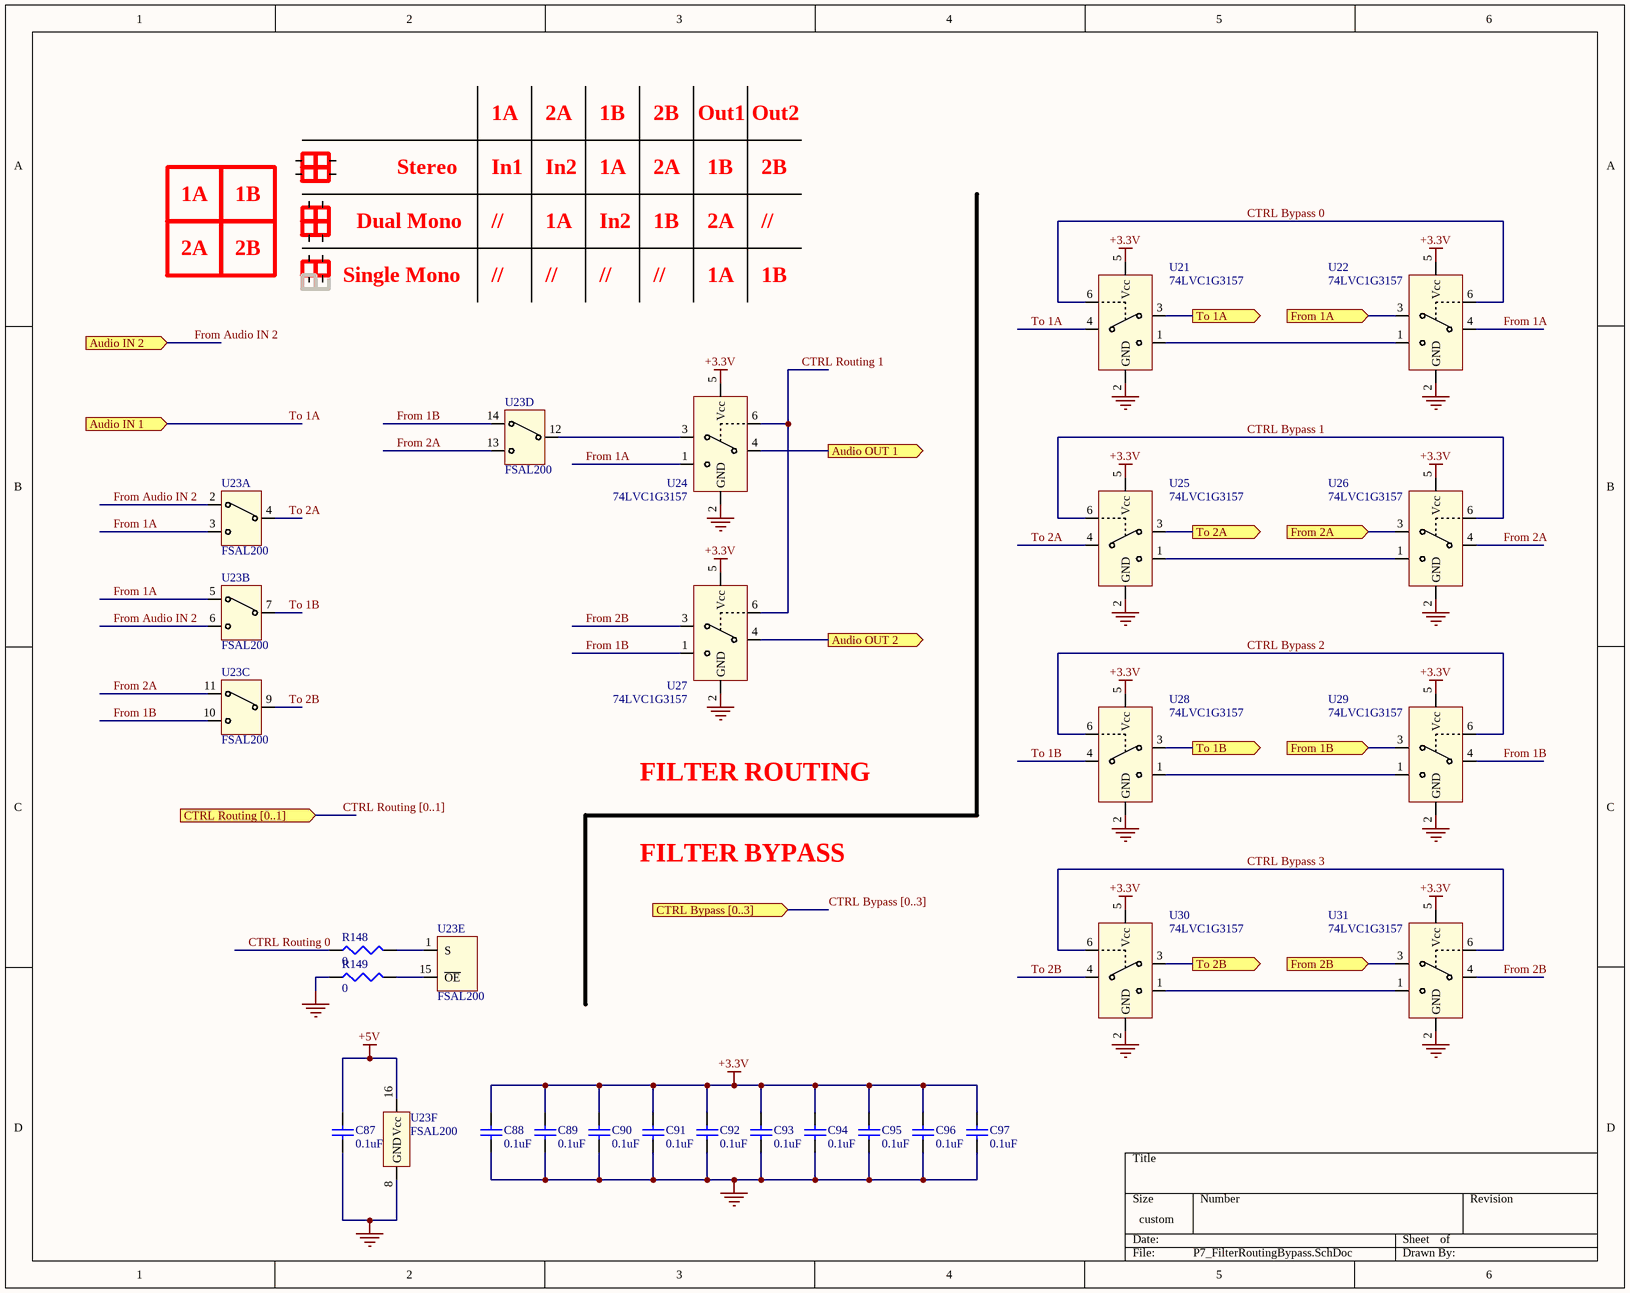
[diagram p6: P7_FilterRoutingBypass.SchDoc]

### Parts
C87  0.1uF  [CAP 0603 (1608 metric)]
C88  0.1uF  [CAP 0603 (1608 metric)]
C89  0.1uF  [CAP 0603 (1608 metric)]
C90  0.1uF  [CAP 0603 (1608 metric)]
C91  0.1uF  [CAP 0603 (1608 metric)]
C92  0.1uF  [CAP 0603 (1608 metric)]
C93  0.1uF  [CAP 0603 (1608 metric)]
C94  0.1uF  [CAP 0603 (1608 metric)]
C95  0.1uF  [CAP 0603 (1608 metric)]
C96  0.1uF  [CAP 0603 (1608 metric)]
C97  0.1uF  [CAP 0603 (1608 metric)]
R148  0  [RES 0603 (1608 metric)]
R149  0  [RES 0603 (1608 metric)]
U21  74LVC1G3157
U22  74LVC1G3157
U23  FSAL200  (parts A,B,C,D,E,F of 6)
U24  74LVC1G3157
U25  74LVC1G3157
U26  74LVC1G3157
U27  74LVC1G3157
U28  74LVC1G3157
U29  74LVC1G3157
U30  74LVC1G3157
U31  74LVC1G3157

### Ports
Audio IN 1 (in), Audio IN 2 (in), Audio OUT 1 (out), Audio OUT 2 (out), CTRL Bypass [0..3] (in), CTRL Routing [0..1] (in), From 1A (in), From 1B (in), From 2A (in), From 2B (in), To 1A (out), To 1B (out), To 2A (out), To 2B (out)

### Nets
+3.3V: C88.1 C89.1 C90.1 C91.1 C92.1 C93.1 C94.1 C95.1 C96.1 C97.1 U21.5(Vcc) U22.5(Vcc) U24.5(Vcc) U25.5(Vcc) U26.5(Vcc) U27.5(Vcc) U28.5(Vcc) U29.5(Vcc) U30.5(Vcc) U31.5(Vcc)
+5V: C87.1 U23.16(Vcc)
GND: C87.2 C88.2 C89.2 C90.2 C91.2 C92.2 C93.2 C94.2 C95.2 C96.2 C97.2 R149.1 U21.2(GND) U22.2(GND) U23.8(GND) U24.2(GND) U25.2(GND) U26.2(GND) U27.2(GND) U28.2(GND) U29.2(GND) U30.2(GND) U31.2(GND)
CTRL Bypass 0: U21.6(S) U22.6(S)
CTRL Bypass 1: U25.6(S) U26.6(S)
CTRL Bypass 2: U28.6(S) U29.6(S)
CTRL Bypass 3: U30.6(S) U31.6(S)
CTRL Routing 0: R148.1
CTRL Routing 1: U24.6(S) U27.6(S)
From 1A: U22.4(A) U23.3(B2) U23.5(B1) U24.1(B2)
From 1B: U23.10(B2) U23.14(B1) U27.1(B2) U29.4(A)
From 2A: U23.11(B1) U23.13(B2) U26.4(A)
From 2B: U27.3(B1) U31.4(A)
From Audio IN 2: U23.2(B1) U23.6(B2) ; port Audio IN 2
To 1A: U21.4(A) ; port Audio IN 1
To 1B: U23.7(A) U28.4(A)
To 2A: U23.4(A) U25.4(A)
To 2B: U23.9(A) U30.4(A)
NetC85_Mode_Select_1A_1: U22.3(B1) ; port From 1A
NetC85_Mode_Select_1B_1: U29.3(B1) ; port From 1B
NetC85_Mode_Select_2A_1: U26.3(B1) ; port From 2A
NetC85_Mode_Select_2B_1: U31.3(B1) ; port From 2B
NetR92_2: U25.3(B1) ; port To 2A
NetR112_2: U28.3(B1) ; port To 1B
NetR148_2: R148.2 U23.1(S)
NetR149_2: R149.2 U23.15(~{OE})
NetU4_MS_-_LR_Converter#2_4: U24.4(A) ; port Audio OUT 1
NetU4_MS_-_LR_Converter#2_7: U27.4(A) ; port Audio OUT 2
NetU21_1: U21.1(B2) U22.1(B2)
NetU21_3: U21.3(B1) ; port To 1A
NetU23_12: U23.12(A) U24.3(B1)
NetU25_1: U25.1(B2) U26.1(B2)
NetU28_1: U28.1(B2) U29.1(B2)
NetU30_1: U30.1(B2) U31.1(B2)
NetU30_3: U30.3(B1) ; port To 2B

### Buses and harness runs
bus CTRL Bypass [0..3] = port CTRL Bypass [0..3]
bus CTRL Routing [0..1] = port CTRL Routing [0..1]

### Notes on the sheet
- 1A
- 2A
- 1B
- 2B
- Out1
- Out2
- Dual Mono
- Stereo
- In1
- //
- In2
- Single Mono
- FILTER ROUTING
- FILTER BYPASS

### Library data of the parts
C87-C97 = Cap Semi: Capacitor (Semiconductor SIM Model); Value: 0.1uF
R148 R149 = Res3: Resistor; Value: 0
U21 U22 U24-U31 = 74LVC1G3157: Single 2:1 Multiplexer
U23 = FSAL200: Quad 2:1 Multiplexer

## Sheet P5c_Filter1B.SchDoc
size A
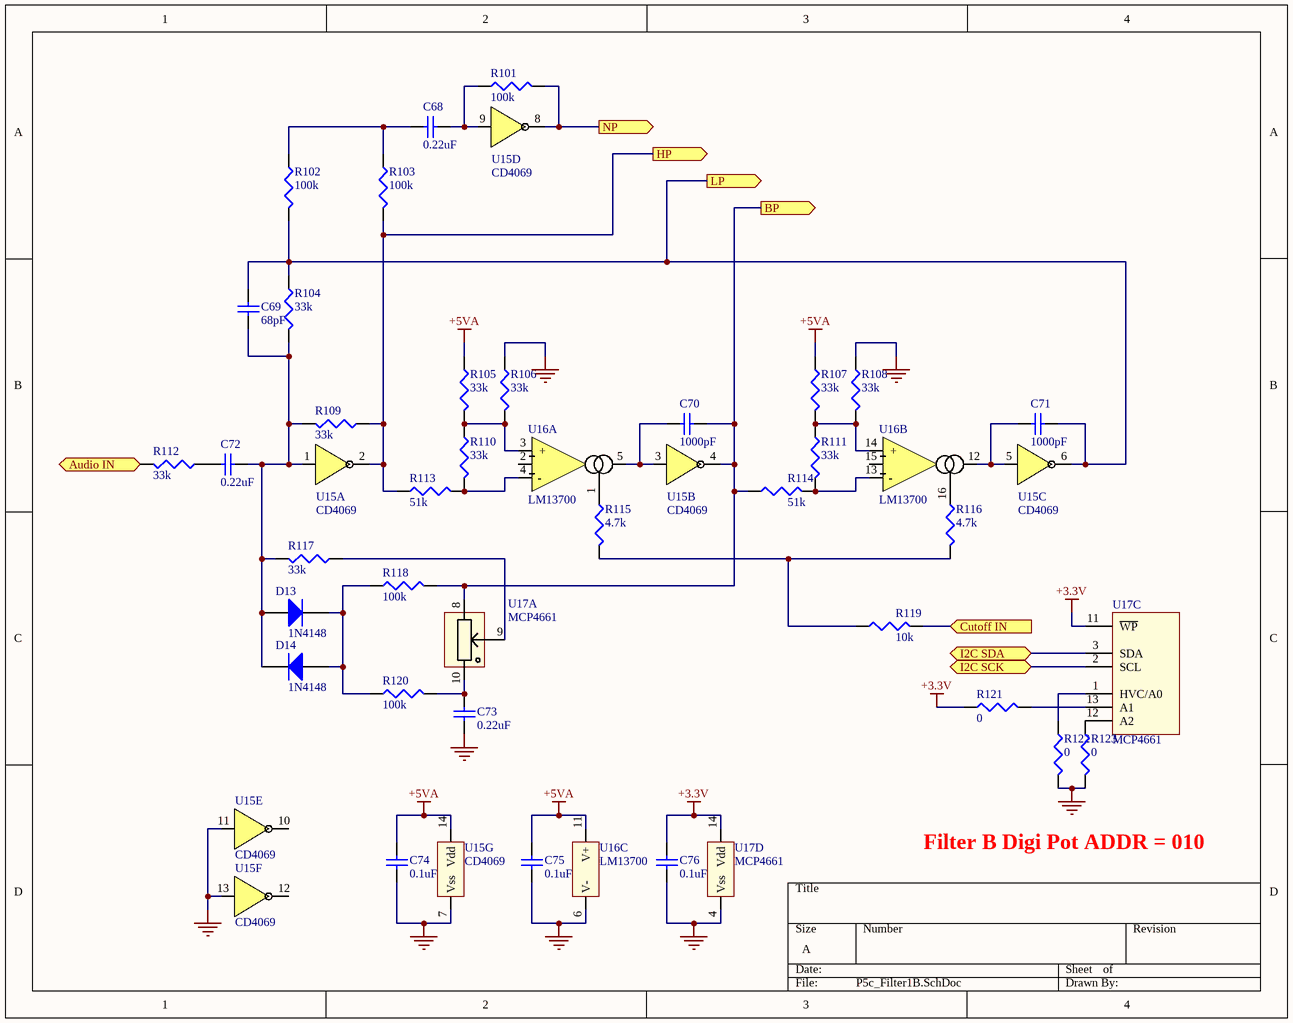
[diagram p7: P5c_Filter1B.SchDoc]

### Parts
C68  0.22uF  [CAP 0603 (1608 metric)]
C69  68pF  [CAP 0603 (1608 metric)]
C70  1000pF  [CAP 0603 (1608 metric)]
C71  1000pF  [CAP 0603 (1608 metric)]
C72  0.22uF  [CAP 0603 (1608 metric)]
C73  0.22uF  [CAP 0603 (1608 metric)]
C74  0.1uF  [CAP 0603 (1608 metric)]
C75  0.1uF  [CAP 0603 (1608 metric)]
C76  0.1uF  [CAP 0603 (1608 metric)]
D13  1N4148
D14  1N4148
R101  100k  [RES 0603 (1608 metric)]
R102  100k  [RES 0603 (1608 metric)]
R103  100k  [RES 0603 (1608 metric)]
R104  33k  [RES 0603 (1608 metric)]
R105  33k  [RES 0603 (1608 metric)]
R106  33k  [RES 0603 (1608 metric)]
R107  33k  [RES 0603 (1608 metric)]
R108  33k  [RES 0603 (1608 metric)]
R109  33k  [RES 0603 (1608 metric)]
R110  33k  [RES 0603 (1608 metric)]
R111  33k  [RES 0603 (1608 metric)]
R112  33k  [RES 0603 (1608 metric)]
R113  51k  [RES 0603 (1608 metric)]
R114  51k  [RES 0603 (1608 metric)]
R115  4.7k  [RES 0603 (1608 metric)]
R116  4.7k  [RES 0603 (1608 metric)]
R117  33k  [RES 0603 (1608 metric)]
R118  100k  [RES 0603 (1608 metric)]
R119  10k  [RES 0603 (1608 metric)]
R120  100k  [RES 0603 (1608 metric)]
R121  0  [RES 0603 (1608 metric)]
R122  0  [RES 0603 (1608 metric)]
R123  0  [RES 0603 (1608 metric)]
U15  CD4069  (parts A,B,C,D,E,F,G of 7)
U16  LM13700  (parts A,B,C of 3)
U17  MCP4661  (parts A,C,D of 4)

### Ports
Audio IN (in), BP (out), Cutoff IN (in), HP (out), I2C SCK, I2C SDA, LP (out), NP (out)

### Nets
+3.3V: C76.1 R121.1 U17.11(~{WP}) U17.14(Vdd)
+5VA: C74.1 C75.1 R105.1 R107.1 U15.14(Vdd) U16.11(V+)
GND: C73.2 C74.2 C75.2 C76.2 R106.1 R108.1 R122.2 R123.2 U15.7(Vss) U15.11(E) U15.13(F) U16.6(V-) U17.4(Vss)
CUTOFF 3: R119.2 ; port Cutoff IN
NetC68_1: C68.1 R102.1 R103.1
NetC68_2: C68.2 R101.1 U15.9(D)
NetC69_1: C69.1 C72.2 D13.1(A) D14.2(K) R104.2 R109.2 R117.2 U15.1(A)
NetC69_2: C69.2 C71.2 R102.2 R104.1 U15.6(~{C}) ; port LP
NetC70_1: C70.1 U15.3(B) U16.5(OUT)
NetC70_2: C70.2 R114.1 R118.2 U15.4(~{B}) U17.8(P0A) ; port BP
NetC71_1: C71.1 U15.5(C) U16.12(OUT)
NetC72_1: C72.1 R112.1
NetC73_1: C73.1 R120.2 U17.10(P0B)
NetD13_2: D13.2(K) D14.1(A) R118.1 R120.1
NetR101_2: R101.2 U15.8(~{D}) ; port NP
NetR103_2: R103.2 R109.1 R113.1 U15.2(~{A}) ; port HP
NetR105_2: R105.2 R106.2 R110.1 U16.3(+)
NetR107_2: R107.2 R108.2 R111.1 U16.14(+)
NetR110_2: R110.2 R113.2 U16.4(-)
NetR111_2: R111.2 R114.2 U16.13(-)
NetR112_2: R112.2 ; port Audio IN
NetR115_1: R115.1 U16.1(BIAS)
NetR115_2: R115.2 R116.2 R119.1
NetR116_1: R116.1 U16.16(BIAS)
NetR117_1: R117.1 U17.9(P0W)
NetR121_2: R121.2 U17.13(A1)
NetR122_1: R122.1 U17.1(HVC/A0)
NetR123_1: R123.1 U17.12(A2)
NetU2_2: U17.2(SCL) ; port I2C SCK
NetU2_3: U17.3(SDA) ; port I2C SDA

Not connected (* = marked no-connect by the designer): U15 10(~{E}) 12(~{F}); U16 2(Diode_BIAS) 15(Diode_BIAS)

### Notes on the sheet
- Filter B Digi Pot ADDR = 010

### Library data of the parts
C68-C76 = Cap Semi: Capacitor (Semiconductor SIM Model)
  C68 C72 C73: Value: 0.22uF
  C69: Value: 68pF
  C70 C71: Value: 1000pF
  C74-C76: Value: 0.1uF
D13 D14 = Diode 1N4148: High Conductance Fast Diode
R101-R123 = Res3: Resistor
  R101-R103 R118 R120: Value: 100k
  R104-R112 R117: Value: 33k
  R113 R114: Value: 51k
  R115 R116: Value: 4.7k
  R119: Value: 10k
  R121-R123: Value: 0
U15 = CD4069: Hex Inverter
U16 = LM13700M: Dual Transconductance OpAmp
U17 = MCP4661: Dual DigiPot non volatile I2C

## Sheet P8_AudioOutput.SchDoc
size A
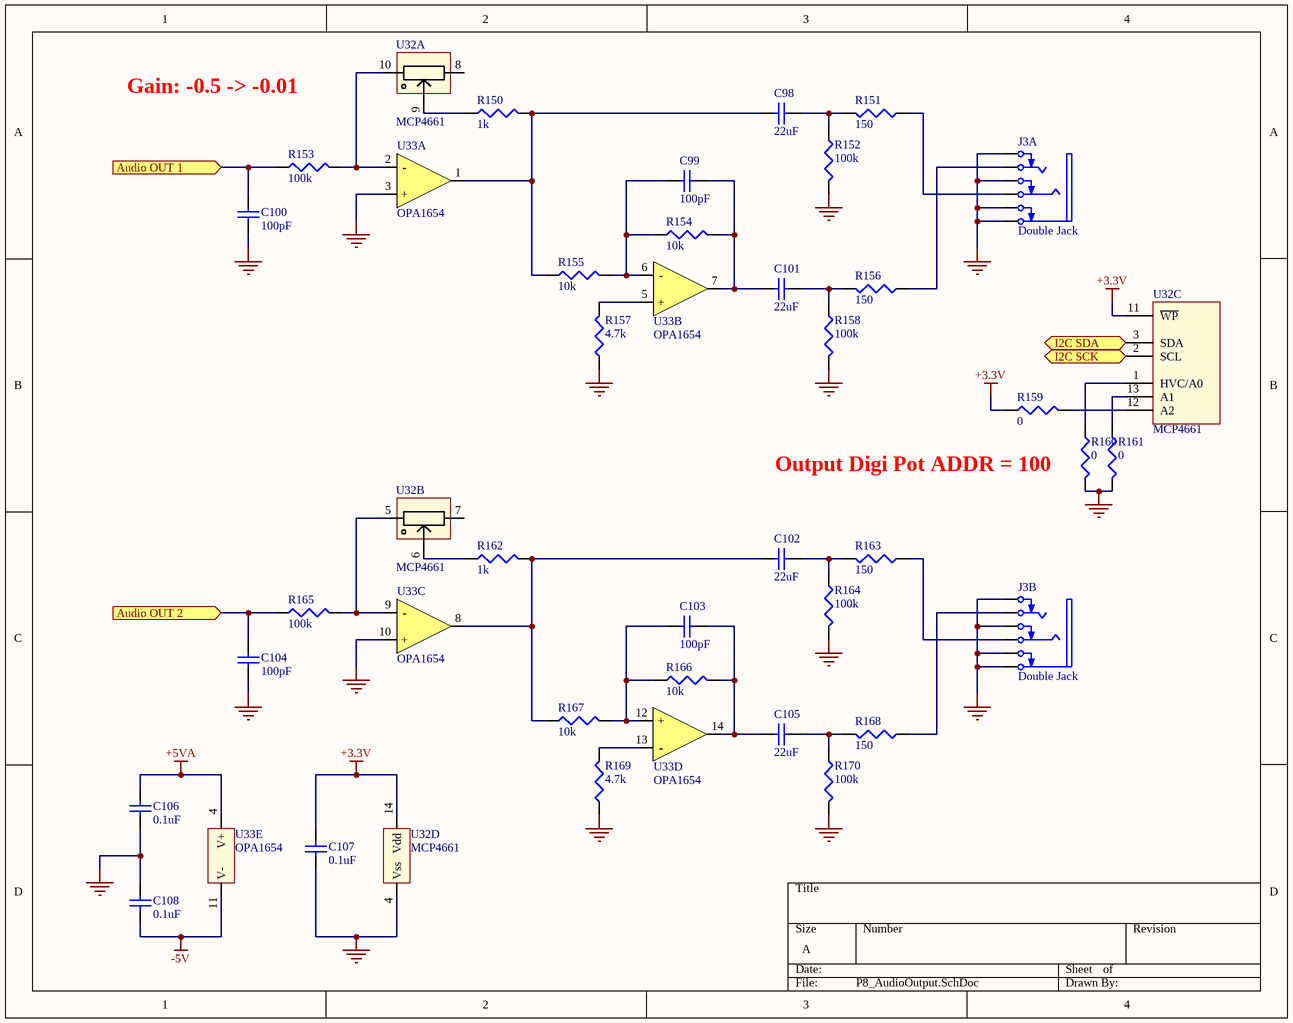
[diagram p8: P8_AudioOutput.SchDoc]

### Parts
C98  22uF  [CAP 0603 (1608 metric)]
C99  100pF  [CAP 0603 (1608 metric)]
C100  100pF  [CAP 0603 (1608 metric)]
C101  22uF  [CAP 0603 (1608 metric)]
C102  22uF  [CAP 0603 (1608 metric)]
C103  100pF  [CAP 0603 (1608 metric)]
C104  100pF  [CAP 0603 (1608 metric)]
C105  22uF  [CAP 0603 (1608 metric)]
C106  0.1uF  [CAP 0603 (1608 metric)]
C107  0.1uF  [CAP 0603 (1608 metric)]
C108  0.1uF  [CAP 0603 (1608 metric)]
J3  Double Jack  (parts A,B of 2)
R150  1k  [RES 0603 (1608 metric)]
R151  150  [RES 0603 (1608 metric)]
R152  100k  [RES 0603 (1608 metric)]
R153  100k  [RES 0603 (1608 metric)]
R154  10k  [RES 0603 (1608 metric)]
R155  10k  [RES 0603 (1608 metric)]
R156  150  [RES 0603 (1608 metric)]
R157  4.7k  [RES 0603 (1608 metric)]
R158  100k  [RES 0603 (1608 metric)]
R159  0  [RES 0603 (1608 metric)]
R160  0  [RES 0603 (1608 metric)]
R161  0  [RES 0603 (1608 metric)]
R162  1k  [RES 0603 (1608 metric)]
R163  150  [RES 0603 (1608 metric)]
R164  100k  [RES 0603 (1608 metric)]
R165  100k  [RES 0603 (1608 metric)]
R166  10k  [RES 0603 (1608 metric)]
R167  10k  [RES 0603 (1608 metric)]
R168  150  [RES 0603 (1608 metric)]
R169  4.7k  [RES 0603 (1608 metric)]
R170  100k  [RES 0603 (1608 metric)]
U32  MCP4661  (parts A,B,C,D of 4)
U33  OPA1654  (parts A,B,C,D,E of 5)

### Ports
Audio OUT 1 (in), Audio OUT 2 (in), I2C SCK, I2C SDA

### Nets
+3.3V: C107.1 R159.1 U32.11(~{WP}) U32.14(Vdd)
+5VA: C106.1 U33.4(V+)
-5V: C108.2 U33.11(V-)
GND: C100.1 C104.1 C106.2 C107.2 C108.1 J3.1(SB) J3.2(RB) J3.3(TB) J3.4(S) J3.7(SB) J3.8(RB) J3.9(TB) J3.10(S) R152.2 R157.1 R158.2 R160.2 R161.2 R164.2 R169.1 R170.2 U32.4(Vss) U33.3(+) U33.10(+)
NetC98_1: C98.1 R151.2 R152.1
NetC98_2: C98.2 R150.2 R155.1 U33.1(OUT)
NetC99_1: C99.1 C101.2 R154.2 U33.7(OUT)
NetC99_2: C99.2 R154.1 R155.2 U33.6(-)
NetC100_2: C100.2 R153.1 ; port Audio OUT 1
NetC101_1: C101.1 R156.2 R158.1
NetC102_1: C102.1 R163.2 R164.1
NetC102_2: C102.2 R162.2 R167.1 U33.8(OUT)
NetC103_1: C103.1 C105.2 R166.2 U33.14(OUT)
NetC103_2: C103.2 R166.1 R167.2 U33.12(+)
NetC104_2: C104.2 R165.1 ; port Audio OUT 2
NetC105_1: C105.1 R168.2 R170.1
NetJ3_5: J3.5(R) R163.1
NetJ3_6: J3.6(T) R168.1
NetJ3_11: J3.11(R) R151.1
NetJ3_12: J3.12(T) R156.1
NetR150_1: R150.1 U32.9(P0W)
NetR153_2: R153.2 U32.10(P0B) U33.2(-)
NetR157_2: R157.2 U33.5(+)
NetR159_2: R159.2 U32.12(A2)
NetR160_1: R160.1 U32.1(HVC/A0)
NetR161_1: R161.1 U32.13(A1)
NetR162_1: R162.1 U32.6(P1W)
NetR165_2: R165.2 U32.5(P1B) U33.9(-)
NetR169_2: R169.2 U33.13(-)
NetU2_2: U32.2(SCL) ; port I2C SCK
NetU2_3: U32.3(SDA) ; port I2C SDA

Not connected (* = marked no-connect by the designer): U32 7(P1A) 8(P0A)

### Notes on the sheet
- Gain: -0.5 -> -0.01
- Output Digi Pot ADDR = 100

### Library data of the parts
C98-C108 = Cap Semi: Capacitor (Semiconductor SIM Model)
  C98 C101 C102 C105: Value: 22uF
  C99 C100 C103 C104: Value: 100pF
  C106-C108: Value: 0.1uF
J3 = Dual TRS Jack Bypassed: Dual Jack stereo bypassed
R150-R170 = Res3: Resistor
  R150 R162: Value: 1k
  R151 R156 R163 R168: Value: 150
  R152 R153 R158 R164 R165 R170: Value: 100k
  R154 R155 R166 R167: Value: 10k
  R157 R169: Value: 4.7k
  R159-R161: Value: 0
U32 = MCP4661: Dual DigiPot non volatile I2C
U33 = OPA1654: Quad Audio OpAmp

## Sheet P10_Expander.SchDoc
size 177 x 101 mm
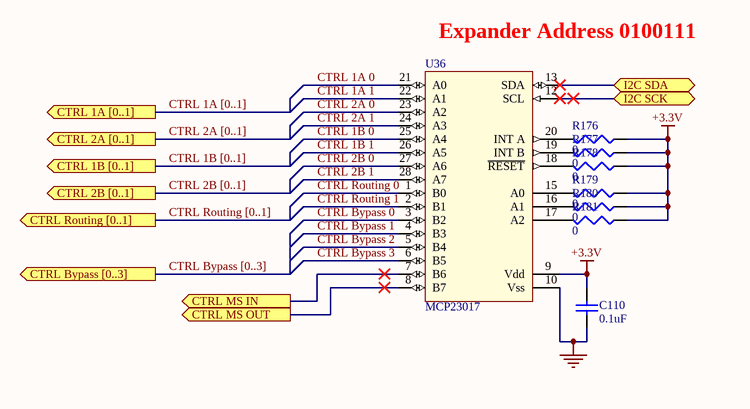
[diagram p9: P10_Expander.SchDoc]

### Parts
C110  0.1uF  [CAP 0603 (1608 metric)]
R176  0  [RES 0603 (1608 metric)]
R177  0  [RES 0603 (1608 metric)]
R178  0  [RES 0603 (1608 metric)]
R179  0  [RES 0603 (1608 metric)]
R180  0  [RES 0603 (1608 metric)]
R181  0  [RES 0603 (1608 metric)]
U36  MCP23017

### Ports
CTRL 1A [0..1] (out), CTRL 1B [0..1] (out), CTRL 2A [0..1] (out), CTRL 2B [0..1] (out), CTRL Bypass [0..3] (out), CTRL MS IN (out), CTRL MS OUT (out), CTRL Routing [0..1] (out), I2C SCK, I2C SDA

### Nets
+3.3V: C110.1 R176.1 R177.1 R178.1 R179.1 R180.1 R181.1 U36.9(Vdd)
GND: C110.2 U36.10(Vss)
CTRL 1A 0: U36.21(A0)  [project net CTRL 0]
CTRL 1A 1: U36.22(A1)  [project net CTRL 1]
CTRL 1B 0: U36.25(A4)  [project net CTRL 0]
CTRL 1B 1: U36.26(A5)  [project net CTRL 1]
CTRL 2A 0: U36.23(A2)  [project net CTRL 0]
CTRL 2A 1: U36.24(A3)  [project net CTRL 1]
CTRL 2B 0: U36.27(A6)  [project net CTRL 0]
CTRL 2B 1: U36.28(A7)  [project net CTRL 1]
CTRL Bypass 0: U36.3(B2)
CTRL Bypass 1: U36.4(B3)
CTRL Bypass 2: U36.5(B4)
CTRL Bypass 3: U36.6(B5)
CTRL Routing 0: U36.1(B0)
CTRL Routing 1: U36.2(B1)
NetR48_MS_-_LR_Converter#1_1: U36.7(B6) ; port CTRL MS IN
NetR48_MS_-_LR_Converter#2_1: U36.8(B7) ; port CTRL MS OUT
NetR176_2: R176.2 U36.20(INT_A)
NetR177_2: R177.2 U36.19(INT_B)
NetR178_2: R178.2 U36.18(~{RESET})
NetR179_2: R179.2 U36.15(A0)
NetR180_2: R180.2 U36.16(A1)
NetR181_2: R181.2 U36.17(A2)
NetU2_2: U36.12(SCL) ; port I2C SCK
NetU2_3: U36.13(SDA) ; port I2C SDA

### Buses and harness runs
bus CTRL 1A [0..1] = port CTRL 1A [0..1]
bus CTRL 1B [0..1] = port CTRL 1B [0..1]
bus CTRL 2A [0..1] = port CTRL 2A [0..1]
bus CTRL 2B [0..1] = port CTRL 2B [0..1]
bus CTRL Bypass [0..3] = port CTRL Bypass [0..3]
bus CTRL Routing [0..1] = port CTRL Routing [0..1]

### Notes on the sheet
- (near U36) Expander Address 0100111

### Library data of the parts
C110 = Cap Semi: Capacitor (Semiconductor SIM Model); Value: 0.1uF
R176-R181 = Res3: Resistor; Value: 0
U36 = MCP23017: 16b I/O Expander

## Sheet P9_MIDI.SchDoc
size 152 x 152 mm
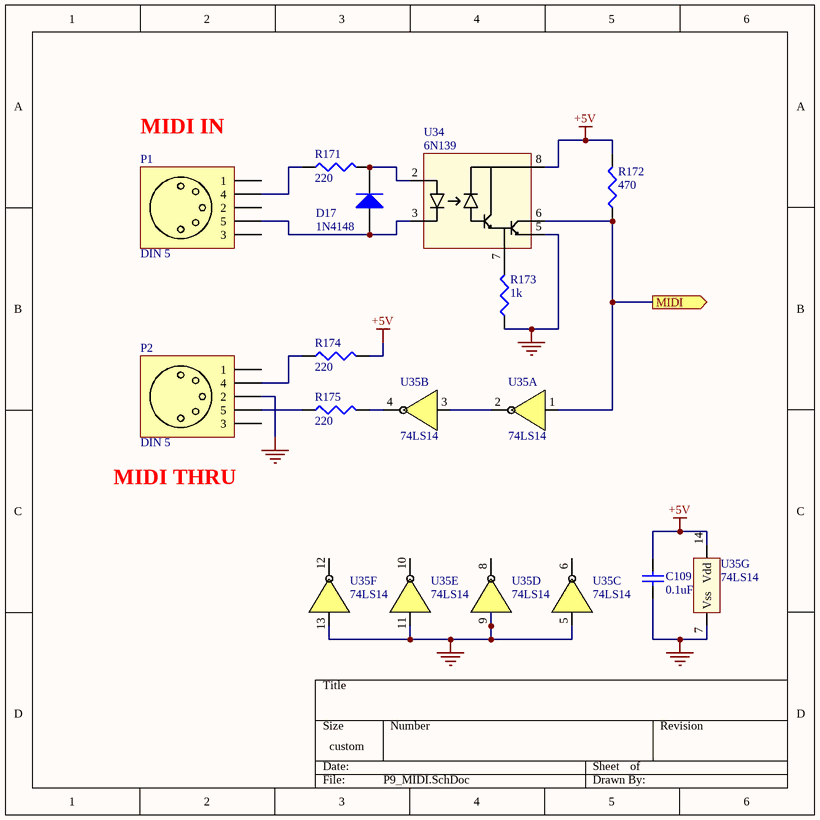
[diagram p10: P9_MIDI.SchDoc]

### Parts
C109  0.1uF  [CAP 0603 (1608 metric)]
D17  1N4148
P1  DIN 5
P2  DIN 5
R171  220  [RES 0603 (1608 metric)]
R172  470  [RES 0603 (1608 metric)]
R173  1k  [RES 0603 (1608 metric)]
R174  220  [RES 0603 (1608 metric)]
R175  220  [RES 0603 (1608 metric)]
U34  6N139
U35  74LS14  (parts A,B,C,D,E,F,G of 7)

### Ports
MIDI (out)

### Nets
+5V: C109.1 R172.2 R174.2 U34.8(B1) U35.14(Vdd)
GND: C109.2 P2.2 R173.1 U34.5(B1) U35.5(C) U35.7(Vss) U35.9(D) U35.11(E) U35.13(F)
NetD17_1: D17.1(A) P1.5 U34.3(B1)
NetD17_2: D17.2(K) R171.2 U34.2(B2)
NetP1_4: P1.4 R171.1
NetP2_4: P2.4 R174.1
NetP2_5: P2.5 R175.1
NetR172_1: R172.1 U34.6(B1) U35.1(A) ; port MIDI
NetR173_2: R173.2 U34.7(B1)
NetR175_2: R175.2 U35.4(~{B})
NetU35_2: U35.2(~{A}) U35.3(B)

Not connected (* = marked no-connect by the designer): P1 1 2 3; P2 1 3; U35 6(~{C}) 8(~{D}) 10(~{E}) 12(~{F})

### Notes on the sheet
- (near P1) MIDI IN
- (near P2) MIDI THRU

### Library data of the parts
C109 = Cap Semi: Capacitor (Semiconductor SIM Model); Value: 0.1uF
D17 = Diode 1N4148: High Conductance Fast Diode
P1 P2 = DIN 5pin
R171-R175 = Res3: Resistor
  R171 R174 R175: Value: 220
  R172: Value: 470
  R173: Value: 1k
U34 = 6N139: Optocoupler
U35 = 74LS14: Hex Inverter

## Nets that join several sheets
+3.3V: P2_AudioInput (C24.1 U2.11 U2.14), P1_Alim (R3.1), Mode Select 1A (C86_Mode_Select_1A.1 U20_Mode_Select_1A.16), Mode Select 2A (C86_Mode_Select_2A.1 U20_Mode_Select_2A.16), P7_FilterRoutingBypass (20 pins), P5c_Filter1B (C76.1 R121.1 U17.11 U17.14), Mode Select 1B (C86_Mode_Select_1B.1 U20_Mode_Select_1B.16), Mode Select 2B (C86_Mode_Select_2B.1 U20_Mode_Select_2B.16), P8_AudioOutput (C107.1 R159.1 U32.11 U32.14), P10_Expander (8 pins)
+5V: P1_Alim (R2.2), P7_FilterRoutingBypass (C87.1 U23.16), P9_MIDI (5 pins)
+5VA: P2_AudioInput (C22.1 C23.1 U1.4 U3.8), P1_Alim (R1.2), MS - LR Converter (6 pins), P5b_Filter2A (6 pins), P5c_Filter1B (6 pins), MS - LR Converter (6 pins), P8_AudioOutput (C106.1 U33.4)
-5V: P2_AudioInput (C25.2 C26.2 U1.11 U3.4), P1_Alim (R4.1), MS - LR Converter (C41_MS_-_LR_Converter#1.2 C42_MS_-_LR_Converter#1.2 U5_MS_-_LR_Converter#1.11 U6_MS_-_LR_Converter#1.4), MS - LR Converter (C41_MS_-_LR_Converter#2.2 C42_MS_-_LR_Converter#2.2 U5_MS_-_LR_Converter#2.11 U6_MS_-_LR_Converter#2.4), P8_AudioOutput (C108.2 U33.11)
GND: P1_Alim (18 pins), MS - LR Converter (17 pins), Mode Select 1A (8 pins), P5b_Filter2A (9 pins), Mode Select 2A (8 pins), P7_FilterRoutingBypass (23 pins), P5c_Filter1B (13 pins), Mode Select 1B (8 pins), Mode Select 2B (8 pins), MS - LR Converter (17 pins), P8_AudioOutput (24 pins), P10_Expander (C110.2 U36.10), P9_MIDI (9 pins)
CTRL 0: Mode Select 1A (R145_Mode_Select_1A.1), P10_Expander (U36.21)
CTRL 0: Mode Select 2A (R145_Mode_Select_2A.1), P10_Expander (U36.23)
CTRL 0: Mode Select 1B (R145_Mode_Select_1B.1), P10_Expander (U36.25)
CTRL 0: Mode Select 2B (R145_Mode_Select_2B.1), P10_Expander (U36.27)
CTRL 1: Mode Select 1A (R146_Mode_Select_1A.1), P10_Expander (U36.22)
CTRL 1: Mode Select 2A (R146_Mode_Select_2A.1), P10_Expander (U36.24)
CTRL 1: Mode Select 1B (R146_Mode_Select_1B.1), P10_Expander (U36.26)
CTRL 1: Mode Select 2B (R146_Mode_Select_2B.1), P10_Expander (U36.28)
CTRL Bypass 0: P7_FilterRoutingBypass (U21.6 U22.6), P10_Expander (U36.3)
CTRL Bypass 1: P7_FilterRoutingBypass (U25.6 U26.6), P10_Expander (U36.4)
CTRL Bypass 2: P7_FilterRoutingBypass (U28.6 U29.6), P10_Expander (U36.5)
CTRL Bypass 3: P7_FilterRoutingBypass (U30.6 U31.6), P10_Expander (U36.6)
CTRL Routing 0: P7_FilterRoutingBypass (R148.1), P10_Expander (U36.1)
CTRL Routing 1: P7_FilterRoutingBypass (U24.6 U27.6), P10_Expander (U36.2)
NetC17_1: P2_AudioInput (C17.1 R15.1), MS - LR Converter (U4_MS_-_LR_Converter#1.4)
NetC31_1: P2_AudioInput (C31.1 R30.1), MS - LR Converter (U4_MS_-_LR_Converter#1.7)
NetC61_2: P5b_Filter2A (5 pins), Mode Select 2A (U20_Mode_Select_2A.14)
NetC62_2: P5b_Filter2A (5 pins), Mode Select 2A (U20_Mode_Select_2A.15)
NetC69_2: P5c_Filter1B (5 pins), Mode Select 1B (U20_Mode_Select_1B.14)
NetC70_2: P5c_Filter1B (5 pins), Mode Select 1B (U20_Mode_Select_1B.15)
NetC85_Mode_Select_1A_1: Mode Select 1A (C85_Mode_Select_1A.1 R144_Mode_Select_1A.1), P7_FilterRoutingBypass (U22.3)
NetC85_Mode_Select_1B_1: P7_FilterRoutingBypass (U29.3), Mode Select 1B (C85_Mode_Select_1B.1 R144_Mode_Select_1B.1)
NetC85_Mode_Select_2A_1: Mode Select 2A (C85_Mode_Select_2A.1 R144_Mode_Select_2A.1), P7_FilterRoutingBypass (U26.3)
NetC85_Mode_Select_2B_1: P7_FilterRoutingBypass (U31.3), Mode Select 2B (C85_Mode_Select_2B.1 R144_Mode_Select_2B.1)
NetC100_2: MS - LR Converter (U4_MS_-_LR_Converter#2.12), P8_AudioOutput (C100.2 R153.1)
NetC104_2: MS - LR Converter (U4_MS_-_LR_Converter#2.9), P8_AudioOutput (C104.2 R165.1)
NetR48_MS_-_LR_Converter#1_1: MS - LR Converter (R48_MS_-_LR_Converter#1.1), P10_Expander (U36.7)
NetR48_MS_-_LR_Converter#2_1: MS - LR Converter (R48_MS_-_LR_Converter#2.1), P10_Expander (U36.8)
NetR81_2: P5b_Filter2A (R81.2 U13.8), Mode Select 2A (U20_Mode_Select_2A.11)
NetR83_2: P5b_Filter2A (R83.2 R89.1 R93.1 U13.2), Mode Select 2A (U20_Mode_Select_2A.12)
NetR92_2: P5b_Filter2A (R92.2), P7_FilterRoutingBypass (U25.3)
NetR101_2: P5c_Filter1B (R101.2 U15.8), Mode Select 1B (U20_Mode_Select_1B.11)
NetR103_2: P5c_Filter1B (R103.2 R109.1 R113.1 U15.2), Mode Select 1B (U20_Mode_Select_1B.12)
NetR112_2: P7_FilterRoutingBypass (U28.3), P5c_Filter1B (R112.2)
NetU2_2: P2_AudioInput (U2.2), P5c_Filter1B (U17.2), P8_AudioOutput (U32.2), P10_Expander (U36.12)
NetU2_3: P2_AudioInput (U2.3), P5c_Filter1B (U17.3), P8_AudioOutput (U32.3), P10_Expander (U36.13)
NetU4_MS_-_LR_Converter#2_4: P7_FilterRoutingBypass (U24.4), MS - LR Converter (U4_MS_-_LR_Converter#2.4)
NetU4_MS_-_LR_Converter#2_7: P7_FilterRoutingBypass (U27.4), MS - LR Converter (U4_MS_-_LR_Converter#2.7)